# EAGLE board star (EAGLE 9.6.2)
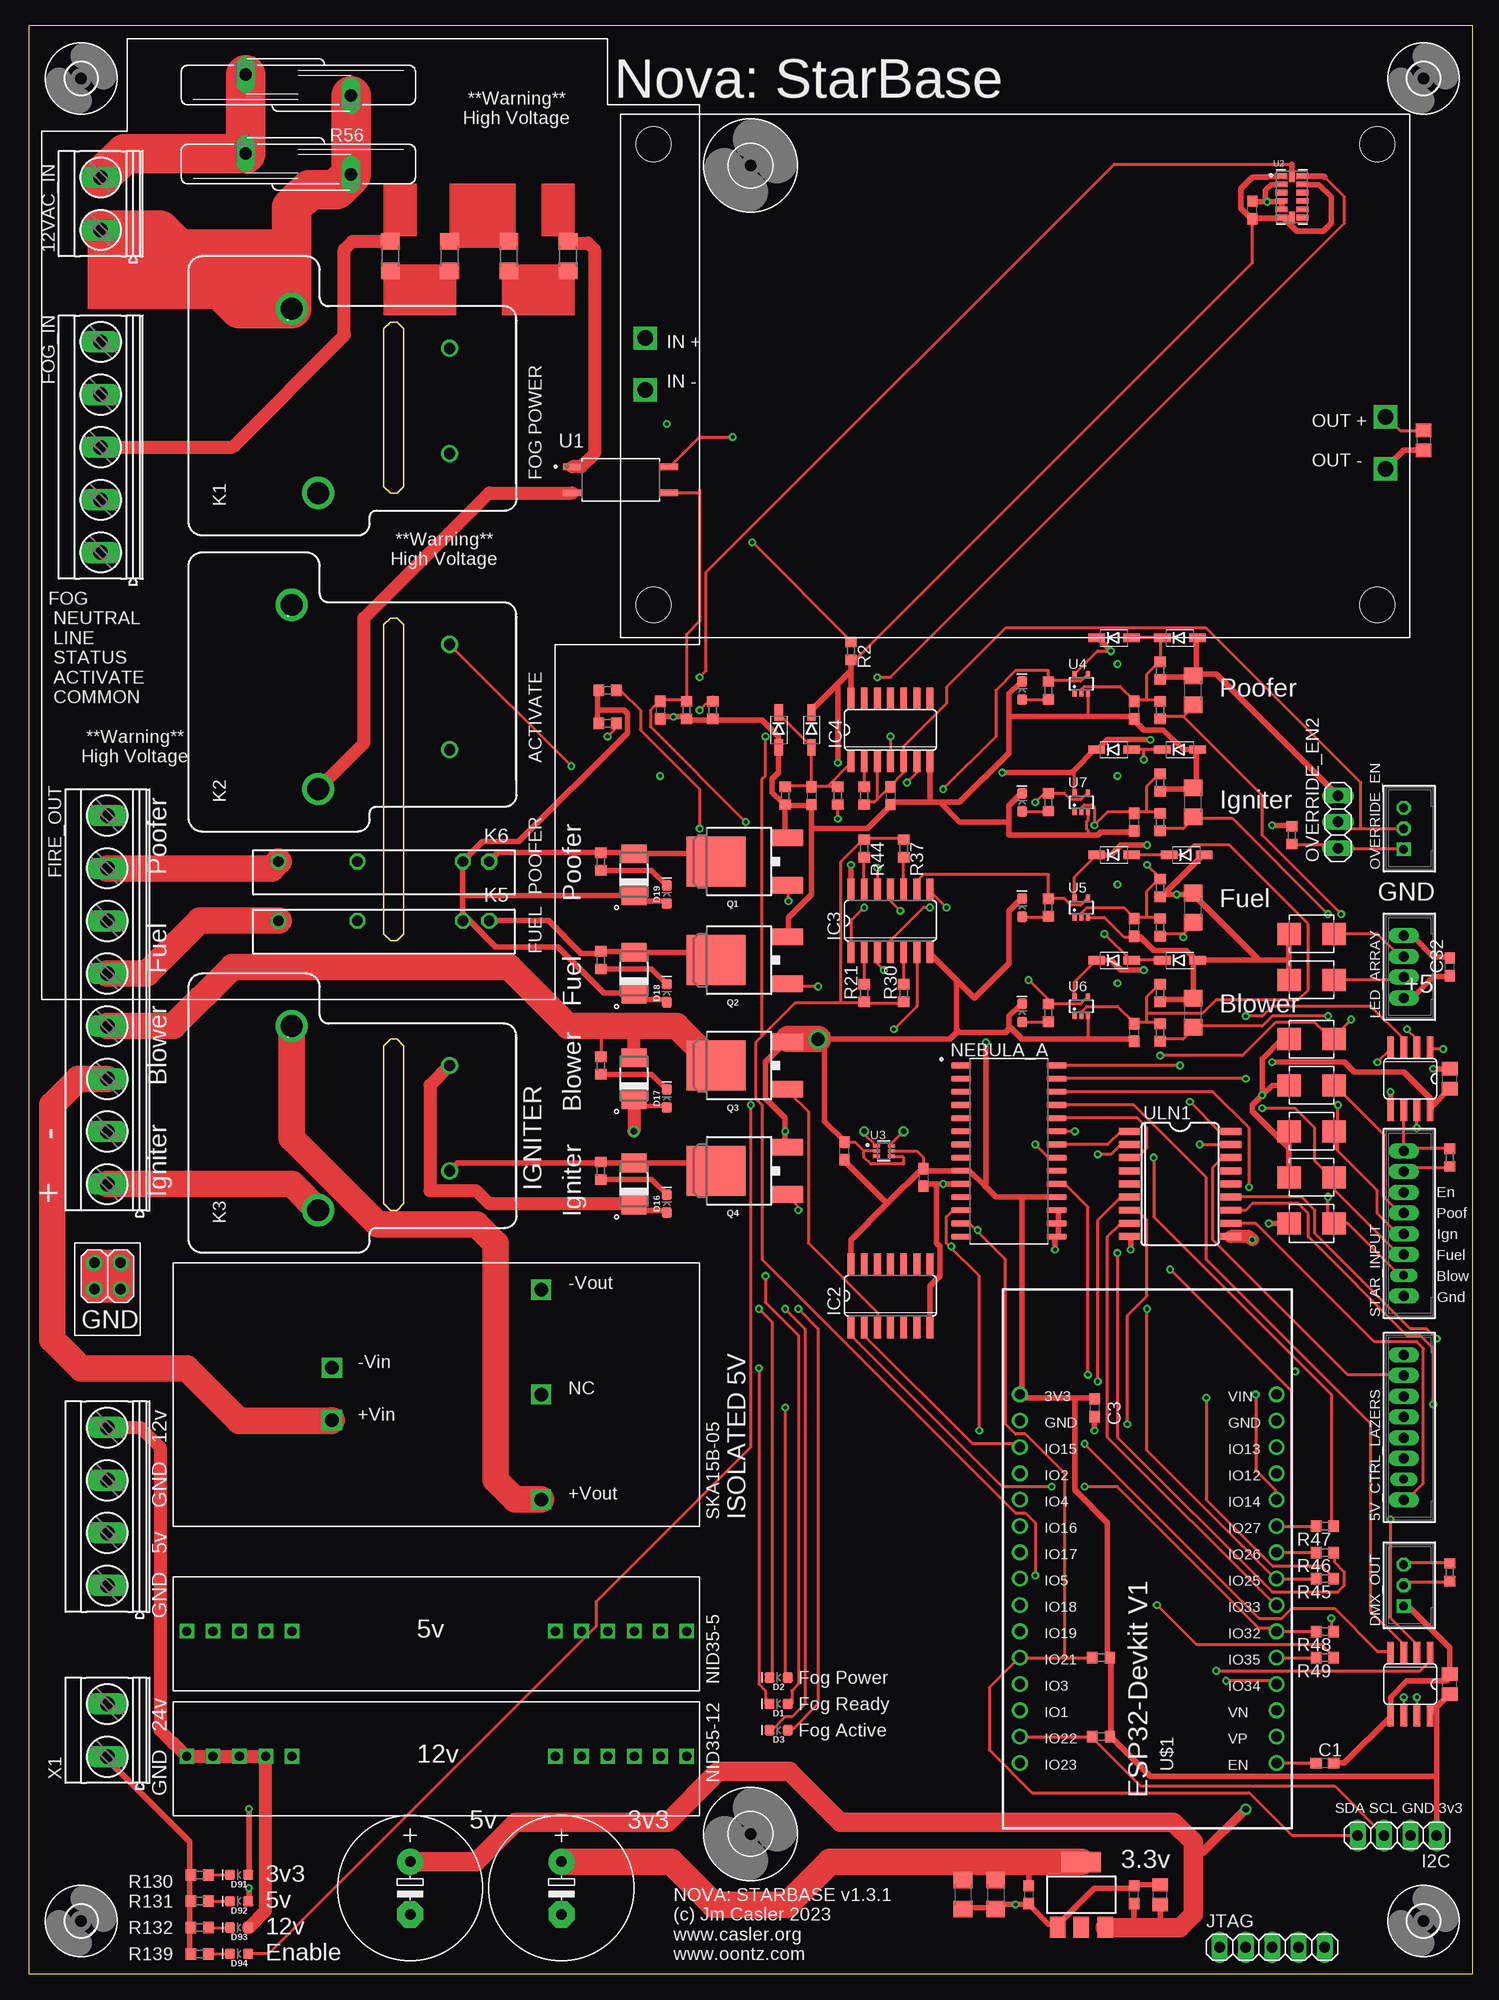
[diagram p2: board, top side]
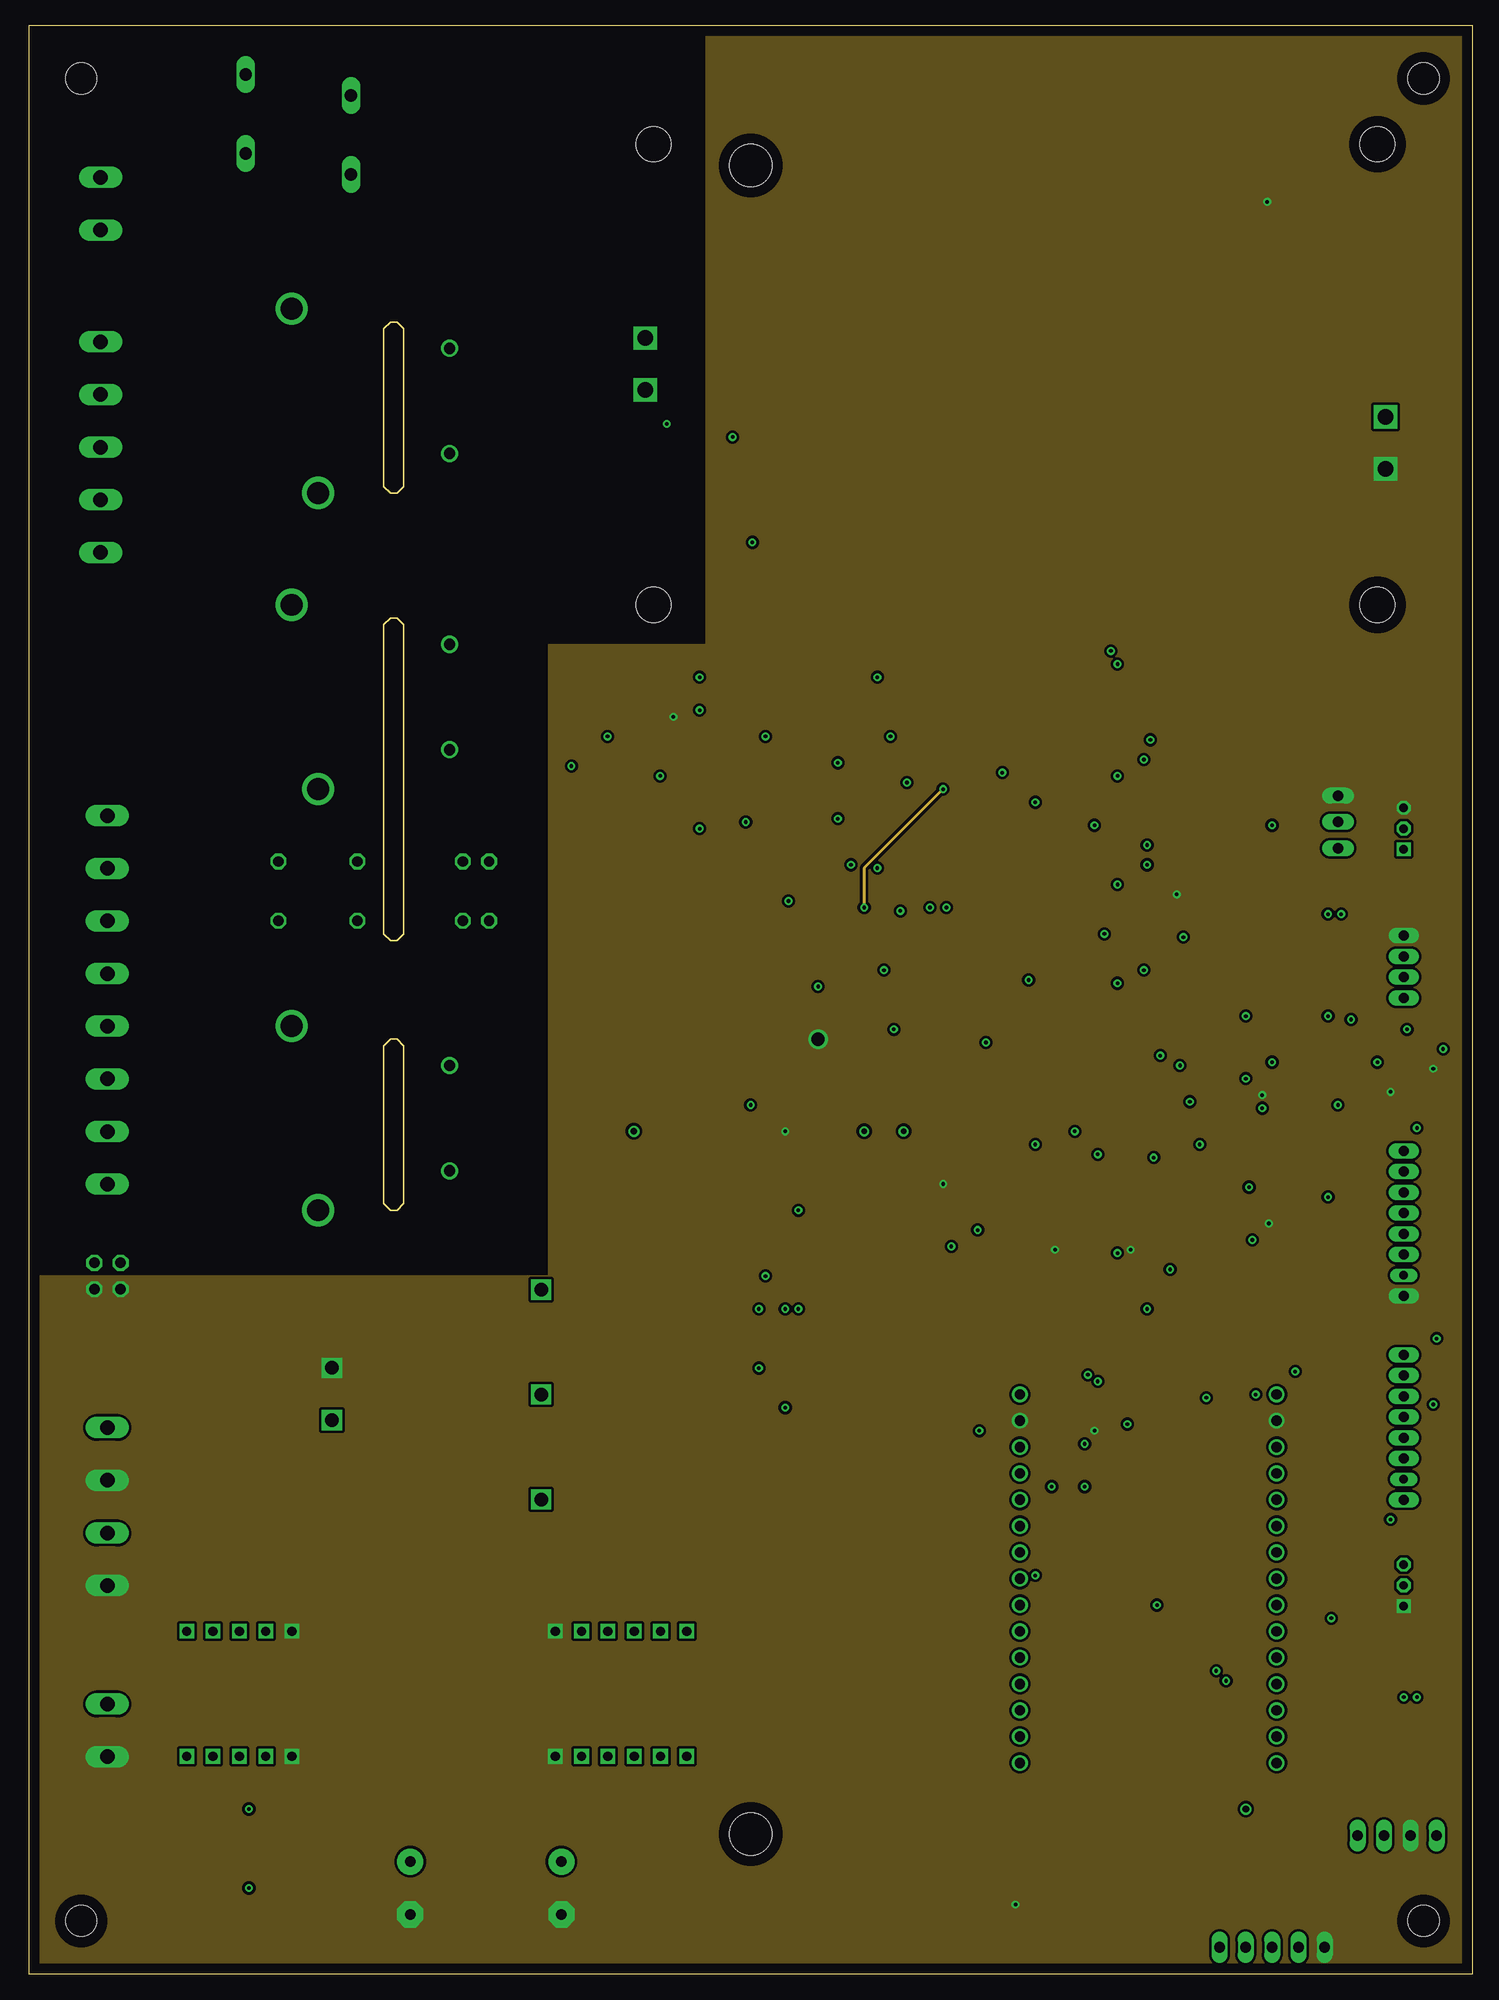
[diagram p3: board, inner layer $GND]
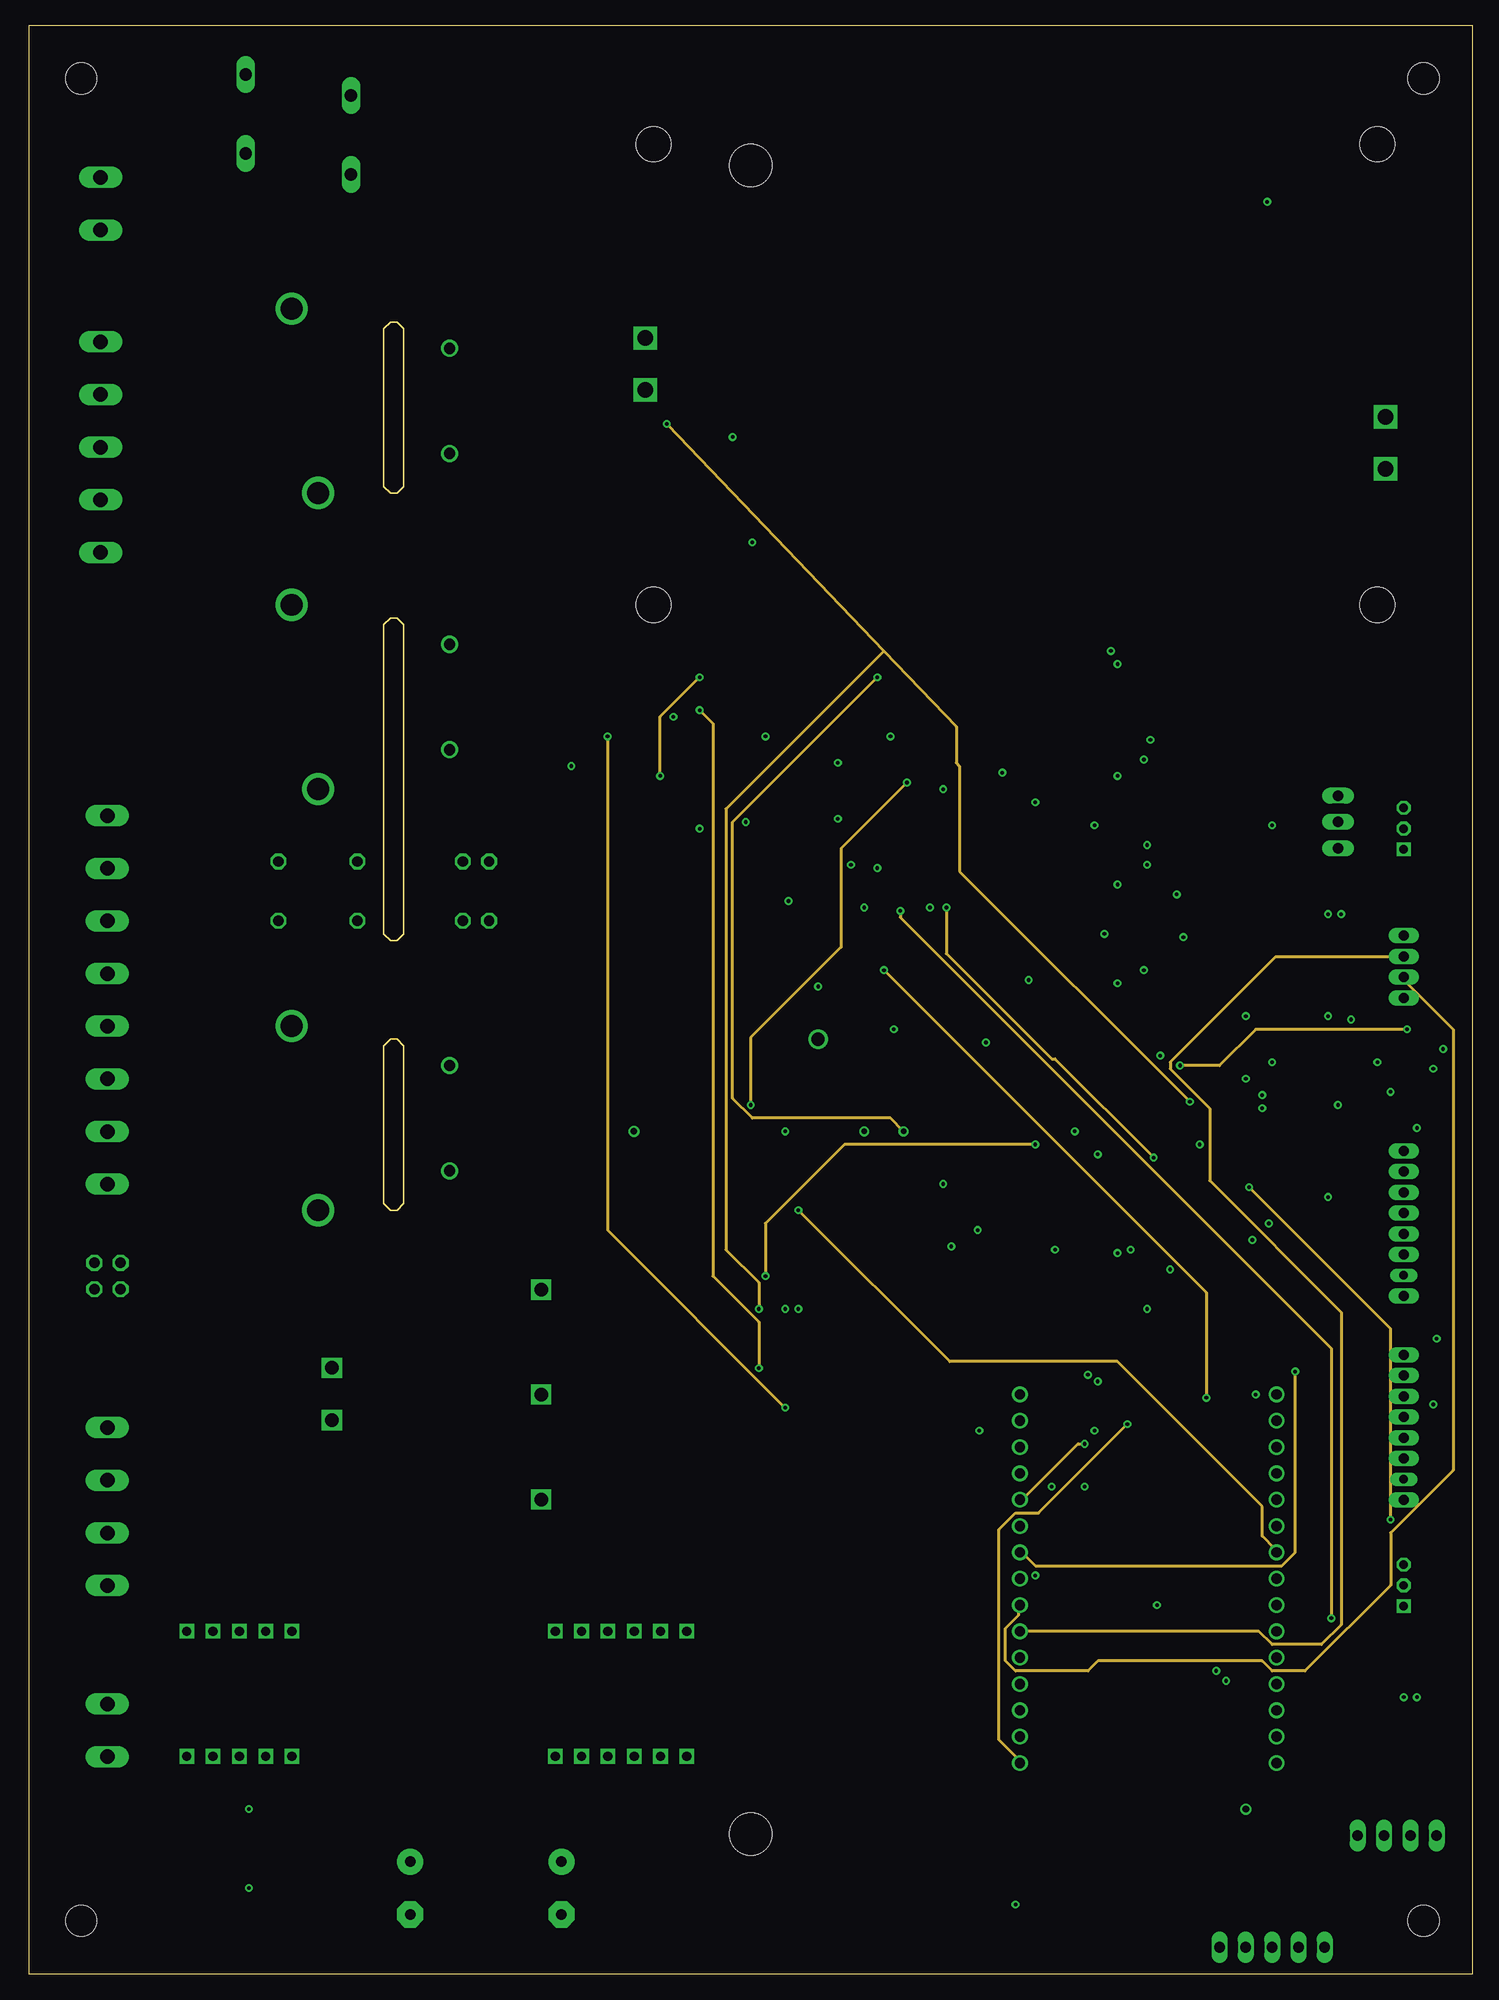
[diagram p4: board, inner layer SIGNAL3]
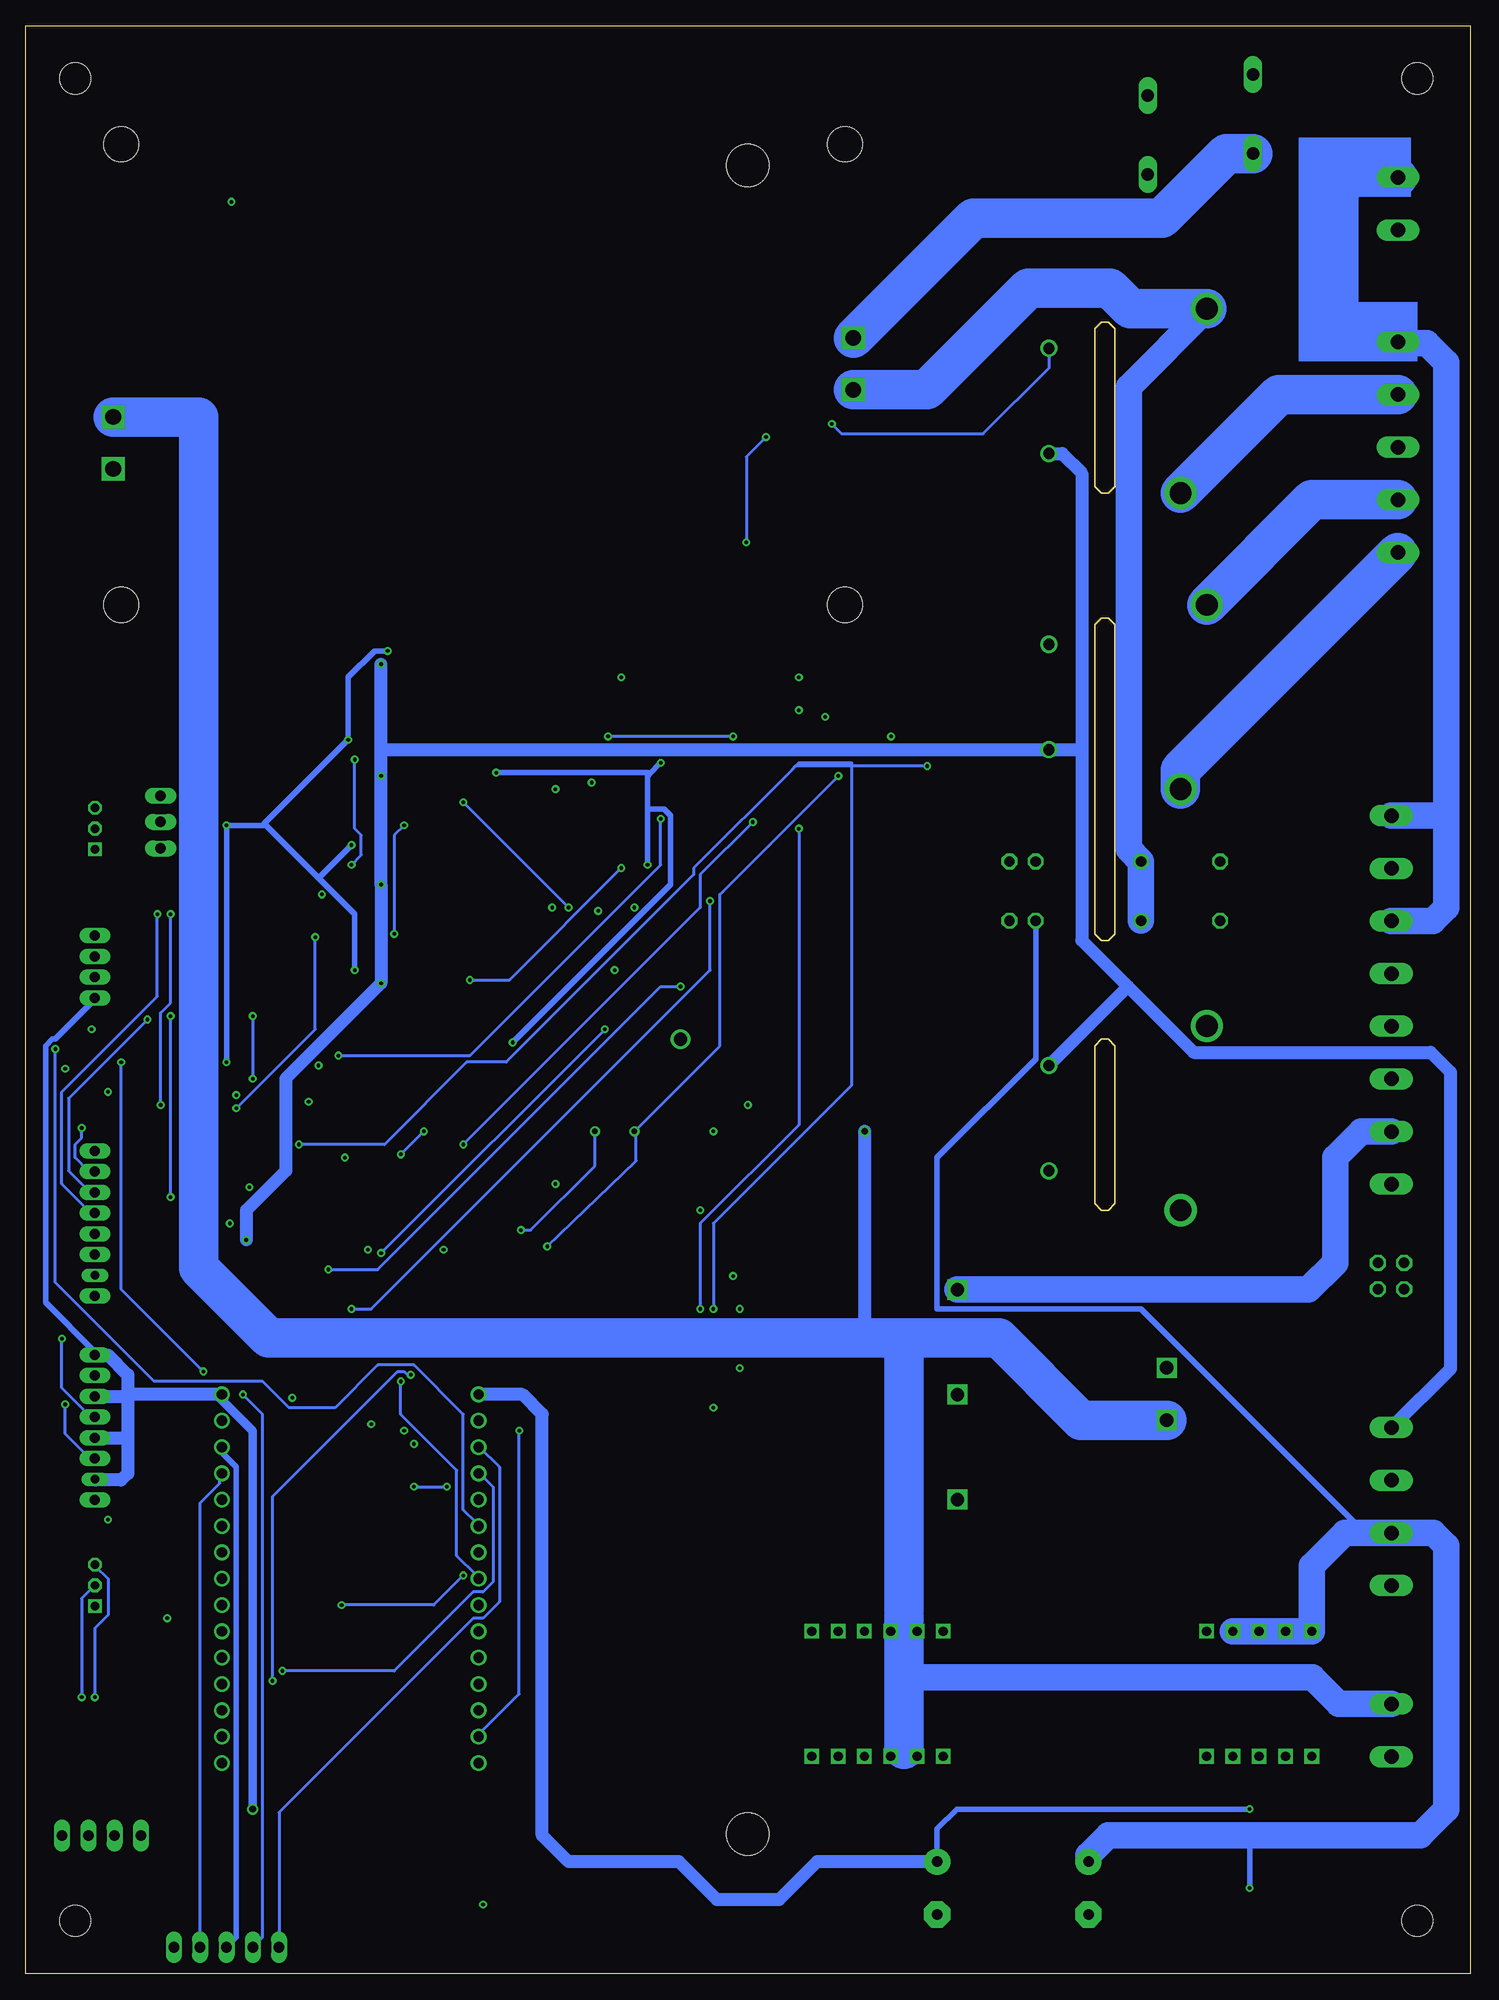
[diagram p5: board, bottom side, seen from below]

Size 139.37 x 187.95 mm. Coordinates in mm from the lower left corner, seen from the top.
Outline: 0,0 139.37,0 139.37,187.95 0,187.95 0,0
Copper layers (1+2*15+16): Top 0.035mm / dielectric 1.5mm / $GND 0.035mm / dielectric 0.15mm / SIGNAL3 0.035mm / dielectric 0.2mm / Bottom 0.035mm
Design rules "default *": minimum track width 6mil, minimum drill 0.35mm, track to track 6mil, track to pad 6mil, pad to pad 6mil, via to via 6mil, smd to smd 5mil, copper to edge 40mil, drill to drill 6mil, minimum pad ring 10mil, minimum via ring 8mil, stop-mask expansion 4mil, vias tented up to drill 20mil, thermal gap 10mil
Net classes: 0 default: width 0.305 mm, clearance 0.203 mm; 1 GND: width 0.305 mm, clearance 0.254 mm; 2 12V: width 1.27 mm, clearance 0.254 mm; 3 5V: width 0.508 mm, clearance 0.254 mm; 4 3V3: width 0.305 mm, clearance 0.254 mm; 5 12V_FUSED: width 0.635 mm, clearance 0.254 mm; 6 120VAC_PWR: width 1.27 mm, clearance 0.508 mm; 7 120VAC: width 1.27 mm, clearance 0.508 mm; 8 60V: width 1.27 mm, clearance 0.508 mm
tRestrict: area 34.3,142.9 to 36.2,159.4; area 34.3,99.7 to 36.2,130.8; area 34.3,73.7 to 36.2,90.2
bRestrict: area 34.3,142.9 to 36.2,159.4; area 34.3,99.7 to 36.2,130.8; area 34.3,73.7 to 36.2,90.2
Milling: 24 lines

## Footprints (pad centres in the part's own frame; a part is rotated, then mirrored left to right if it is on the bottom)
B8B-PH-K = drill 0.965 long: 1 -7,0; 3 -3,0; 4 -1,0; 5 1,0; 6 3,0; 7 5,0; 8 7,0 | drill 0.813 long: 2 -5,0
MKDSN1,5/2-5,08 = drill 1.397 pad 2 long: 1 -2.561,0.025; 2 2.519,0.025
C0603 = smd 1.1 x 1: 1 -0.85,0; 2 0.85,0
C0805 = smd 1.3 x 1.5: 1 -0.95,0; 2 0.95,0
C1206 = smd 1.6 x 1.8: 1 -1.4,0; 2 1.4,0
E5-13 = drill 1.016 pad 2.54: + -2.54,0 | drill 1.016 pad 2.54 octagon: - 2.54,0
LED-0603 = smd 1 x 1: A -0.877,0; C 0.877,0
DIOM4336X265N = smd 2.28 x 2.12: 1 -2.165,0; 2 2.165,0
DO-214AC = smd 1.8 x 2.4: A 2.025,0; C -2.025,0
SOD123 = smd 1.6 x 0.8: A 1.7,0; C -1.7,0
B3B-PH-K = drill 0.813 square: 1 -2,0 | drill 0.813 octagon: 2 0,0; 3 2,0
EPS-25 = drill 1.5 square: IN+ 2.365,28.92; IN- 2.365,23.92; OUT+ 73.795,21.3; OUT- 73.795,16.3 | hole 3.4: 3.175,47.625; 73.025,47.625; 73.025,3.175; 3.175,3.175
MKDSN1,5/8-5,08 = drill 1.397 pad 2 long: 1 -17.801,0.025; 2 -12.721,0.025; 3 -7.641,0.025; 4 -2.561,0.025; 5 2.519,0.025; 6 7.599,0.025; 7 12.679,0.025; 8 17.759,0.025
MKDSN1,5/5-5,08 = drill 1.397 pad 2 long: 1 -10.181,0.025; 2 -5.101,0.025; 3 -0.021,0.025; 4 5.059,0.025; 5 10.139,0.025
3,0 = hole 3: 0,0
4,1 = hole 4.1: 0,0
1X04 = drill 1.016 long: 1 -3.81,0; 2 -1.27,0; 3 1.27,0; 4 3.81,0
SO08 = smd 0.66 x 2.032: 1 -1.905,-3.073; 2 -0.635,-3.073; 3 0.635,-3.073; 4 1.905,-3.073; 5 1.905,3.073; 6 0.635,3.073; 7 -0.635,3.073; 8 -1.905,3.073
SO14 = smd 0.66 x 2.032: 1 -3.81,-3.073; 2 -2.54,-3.073; 3 -1.27,-3.073; 4 0,-3.073; 5 1.27,-3.073; 6 2.54,-3.073; 7 3.81,-3.073; 8 3.81,3.073; 9 2.54,3.073; 10 1.27,3.073; 11 0,3.073; 12 -1.27,3.073; 13 -2.54,3.073; 14 -3.81,3.073
SOT223 = smd 1.5 x 2: 1 -2.3,-3.15; 2 0,-3.15; 3 2.3,-3.15 | smd 3.8 x 2: 4 0,3.15
2X02 = drill 1.016 octagon: 1 -1.27,-1.27; 2 -1.27,1.27; 3 1.27,-1.27; 4 1.27,1.27
1X05 = drill 1.016 long: 1 -5.08,0; 2 -2.54,0; 3 0,0; 4 2.54,0; 5 5.08,0
JT1A-PCB = drill 1.1: 1 5.08,0; 2 -5.08,0 | drill 2.1: C -8.89,12.7; NO 8.89,15.24
AQG = drill 1 octagon: + -7.62,0; - -10.16,0; O1 2.54,0; O2 10.16,0
B4B-PH-K = drill 0.965 long: 1 -3,0; 2 -1,0; 3 1,0; 4 3,0
SOIC127P1030X265-28N = smd 1.9 x 0.6: 1 -4.605,8.255; 2 -4.605,6.985; 3 -4.605,5.715; 4 -4.605,4.445; 5 -4.605,3.175; 6 -4.605,1.905; 7 -4.605,0.635; 8 -4.605,-0.635; 9 -4.605,-1.905; 10 -4.605,-3.175; 11 -4.605,-4.445; 12 -4.605,-5.715; 13 -4.605,-6.985; 14 -4.605,-8.255; 15 4.605,-8.255; 16 4.605,-6.985; 17 4.605,-5.715; 18 4.605,-4.445; 19 4.605,-3.175; 20 4.605,-1.905; 21 4.605,-0.635; 22 4.605,0.635; 23 4.605,1.905; 24 4.605,3.175; 25 4.605,4.445; 26 4.605,5.715; 27 4.605,6.985; 28 4.605,8.255
NID35 = drill 0.9 square: COM1 11.46,5.73; COM2 36.86,5.73; NC 44.48,5.73; RC 49.56,5.73; TRIM 47.02,5.73; VIN1 39.4,5.73; VIN2 41.94,5.73; VOUT1 1.3,5.73; VOUT2 3.84,5.73; VOUT3 6.38,5.73; VOUT4 8.92,5.73
1X03 = drill 1.016 long: 1 -2.54,0; 2 0,0; 3 2.54,0
MKDSN1,5/4-5,08 = drill 1.397 pad 2 long: 1 -7.641,0.025; 2 -2.561,0.025; 3 2.519,0.025; 4 7.599,0.025
DPAK = smd 1.6 x 3: 1 -2.28,-5.31; 3 2.28,-5.31 | smd 4.826 x 5.715: 4 0,1.588
R0603 = smd 1 x 1.1: 1 -0.85,0; 2 0.85,0
R1206 = smd 1.6 x 1.803: 1 -1.422,0; 2 1.422,0
S20K20 = drill 1.194 long: 1 -1.016,-5.08; 2 1.016,5.08
SKA15B = drill 1.3 square: +VIN 15.3,10.22; +VOUT 35.5,2.58; -VIN 15.3,15.28; -VOUT 35.5,22.82; NC 35.5,12.7
SOP254P1015X230-4N = smd 1.84 x 0.64: 1 -4.685,1.27; 2 -4.685,-1.27; 3 4.685,-1.27; 4 4.685,1.27
PQFN80P300X500X100-14N = smd 1.145 x 0.55: 1 -1.01,2; 2 -1.01,1.2; 3 -1.01,0.4; 4 -1.01,-0.4; 5 -1.01,-1.2; 6 -1.01,-2; 8 1.01,-2; 9 1.01,-1.2; 10 1.01,-0.4; 11 1.01,0.4; 12 1.01,1.2; 13 1.01,2 | smd 0.55 x 1.145: 7 0,-2.01; 14 0,2.01
SOT50P160X60-6N = smd 0.67 x 0.3: 1 -0.735,0.5; 2 -0.735,0; 3 -0.735,-0.5; 4 0.735,-0.5; 5 0.735,0; 6 0.735,0.5
SC70-5 = smd 0.4 x 0.6: 1 -0.65,-0.95; 2 0,-0.95; 3 0.65,-0.95; 4 0.65,0.95; 5 -0.65,0.95
ESP32-DEVKITV1 = drill 1 pad 1.422: 1 -22.87,-13.54; 2 -20.33,-13.54; 3 -17.79,-13.54; 4 -15.25,-13.54; 5 -12.71,-13.54; 6 -10.17,-13.54; 7 -7.63,-13.54; 8 -5.09,-13.54; 9 -2.55,-13.54; 10 -0.01,-13.54; 11 2.53,-13.54; 12 5.07,-13.54; 13 7.61,-13.54; 14 10.15,-13.54; 15 12.69,-13.54; 16 12.69,11.23; 17 10.15,11.23; 18 7.61,11.23; 19 5.07,11.23; 20 2.53,11.23; 21 -0.01,11.23; 22 -2.55,11.23; 23 -5.09,11.23; 24 -7.63,11.23; 25 -10.17,11.23; 26 -12.71,11.23; 27 -15.25,11.23; 28 -17.79,11.23; 29 -20.33,11.23; 30 -22.87,11.23
SO18L = smd 0.66 x 2.032: 1 -0.635,-4.902; 2 0.635,-4.902; 3 1.905,-4.902; 4 3.175,-4.902; 5 4.445,-4.902; 6 5.715,-4.902; 7 6.985,-4.902; 8 8.255,-4.902; 9 9.525,-4.902; 10 9.525,4.902; 11 8.255,4.902; 12 6.985,4.902; 13 5.715,4.902; 14 4.445,4.902; 15 3.175,4.902; 16 1.905,4.902; 17 0.635,4.902; 18 -0.635,4.902

## Placement (x,y rotation side)
5V_CTRL_LAZERS  B8B-PH-K  [B8B-PH-K]  132.72,52.7 90 top
12VAC_IN  MKDSN1,5/2-5,08  [MKDSN1,5/2-5,08]  6.99,170.81 90 top
C1  10uf  [C0603]  125.09,20.32 0 top
C2  C_1UF/50V_0603  [C0603]  118.11,170.18 90 top
C3  10uf  [C0603]  102.87,54.61 270 top
C4  C_1UF/50V_0603  [C0603]  78.74,79.38 90 top
C6  1uf  [C0805]  109.22,7.62 90 top
C7  C_1NF/50V_0603  [C0603]  60.96,121.92 270 top
C8  10uf  [C0603]  86.36,76.83 270 top
C11  C_100UF/6.3V_1206  [C1206]  93.34,7.62 270 top
C12  C_100UF/6.3V_1206  [C1206]  90.17,7.62 270 top
C13  C_1NF/2KV_1206  [C1206]  112.39,123.83 90 top
C14  1uf  [C0805]  137.16,86.36 90 top
C15  C_100PF/50V_0603  [C0603]  106.68,121.92 270 top
C16  C_1NF/50V_0603  [C0603]  75.56,113.67 270 top
C17  C_1NF/50V_0603  [C0603]  83.19,113.67 270 top
C18  C_1NF/2KV_1206  [C1206]  112.39,113.03 90 top
C19  C_100PF/50V_0603  [C0603]  106.68,111.12 270 top
C20  C_1NF/2KV_1206  [C1206]  112.39,102.87 90 top
C21  C_100PF/50V_0603  [C0603]  106.68,100.97 270 top
C22  C_1NF/2KV_1206  [C1206]  112.39,92.71 90 top
C23  C_100PF/50V_0603  [C0603]  106.68,90.81 270 top
C25  1uf  [C0805]  134.62,147.96 270 top
C28  2200uf  [E5-13]  51.44,8.26 270 top
C32  C_1UF/50V_0603  [C0603]  137.16,97.16 90 top
C33  1uf  [C0805]  137.16,27.94 90 top
C35  10uf  [C0603]  106.68,7.62 90 top
C36  10uf  [C0603]  96.52,7.62 270 top
C89  2200uf  [E5-13]  36.83,8.26 270 top
D1  red  [LED-0603]  72.39,26.04 180 top
D2  blue  [LED-0603]  72.39,28.57 180 top
D3  blue  [LED-0603]  72.39,23.5 180 top
D4  SMBJ8.0CA  [DIOM4336X265N]  123.83,100.33 0 top
D5  SMBJ8.0CA  [DIOM4336X265N]  123.83,76.83 0 top
D6  green  [LED-0603]  95.89,123.83 90 top
D7  green  [LED-0603]  95.89,113.03 90 top
D8  green  [LED-0603]  95.89,102.87 90 top
D9  green  [LED-0603]  95.89,92.71 90 top
D10  SMBJ8.0CA  [DIOM4336X265N]  123.83,72.39 0 top
D11  SMBJ8.0CA  [DIOM4336X265N]  123.83,81.28 0 top
D12  D_SS210_MDD_SMA  [DO-214AC]  58.42,106.05 90 top
D13  D_SS210_MDD_SMA  [DO-214AC]  58.42,96.52 90 top
D14  D_SS210_MDD_SMA  [DO-214AC]  58.42,86.36 90 top
D15  D_SS210_MDD_SMA  [DO-214AC]  58.42,76.2 90 top
D16  blue  [LED-0603]  61.59,74.3 90 top
D17  blue  [LED-0603]  61.59,84.45 90 top
D18  blue  [LED-0603]  61.59,94.61 90 top
D19  blue  [LED-0603]  61.59,104.14 90 top
D20  SMBJ8.0CA  [DIOM4336X265N]  123.83,90.17 0 top
D21  SMBJ8.0CA  [DIOM4336X265N]  123.83,95.89 0 top
D22  D_B5819W-SL_CHANGJ_SOD123  [SOD123]  104.78,128.91 0 top
D23  D_B5819W-SL_CHANGJ_SOD123  [SOD123]  111.12,128.91 0 top
D24  D_B5819W-SL_CHANGJ_SOD123  [SOD123]  104.78,118.11 0 top
D25  D_B5819W-SL_CHANGJ_SOD123  [SOD123]  111.12,118.11 0 top
D26  D_B5819W-SL_CHANGJ_SOD123  [SOD123]  104.78,107.95 0 top
D27  D_B5819W-SL_CHANGJ_SOD123  [SOD123]  111.76,107.95 0 top
D28  D_B5819W-SL_CHANGJ_SOD123  [SOD123]  104.78,97.79 0 top
D29  D_B5819W-SL_CHANGJ_SOD123  [SOD123]  111.12,97.79 0 top
D30  D_B5819W-SL_CHANGJ_SOD123  [SOD123]  75.56,120.02 270 top
D31  D_B5819W-SL_CHANGJ_SOD123  [SOD123]  72.39,120.02 270 top
D91  red  [LED-0603]  20.32,9.53 180 top
D92  green  [LED-0603]  20.32,6.99 180 top
D93  blue  [LED-0603]  20.32,4.45 180 top
D94  yellow  [LED-0603]  20.32,1.91 180 top
D139  SMBJ8.0CA  [DIOM4336X265N]  123.83,85.72 0 top
DMX_OUT  B3B-PH-K  [B3B-PH-K]  132.72,37.47 90 top
EPP-120S-24  EPP-120S  [EPS-25]  57.15,128.91 0 top
FIRE_OUT  MKDSN1,5/8-5,08  [MKDSN1,5/8-5,08]  7.62,93.98 90 top
FOG_IN  MKDSN1,5/5-5,08  [MKDSN1,5/5-5,08]  6.99,147.32 90 top
H1  MOUNT-HOLE3.0  [3,0]  134.62,5.08 0 top
H2  MOUNT-HOLE3.0  [3,0]  134.62,182.88 0 top
H3  MOUNT-HOLE3.0  [3,0]  5.08,182.88 0 top
H4  MOUNT-HOLE3.0  [3,0]  5.08,5.08 0 top
H5  MOUNT-HOLE4.1  [4,1]  69.69,174.47 0 top
H6  MOUNT-HOLE4.1  [4,1]  69.69,13.47 0 top
I2C  [1X04]  132.08,13.34 180 top
IC1  MAX481CSA  [SO08]  133.35,86.36 180 top
IC2  74HCT08D  [SO14]  83.19,65.41 0 top
IC3  74HCT08D  [SO14]  83.19,101.6 0 top
IC4  7404D  [SO14]  83.19,120.02 0 top
IC8  MAX481CSA  [SO08]  133.35,27.94 180 top
IC22  LD117AS12TR  [SOT223]  101.6,7.62 0 top
JP1  [2X02]  7.62,67.31 0 top
JTAG  [1X05]  120.02,2.54 180 top
K1  T90-12VDC-TL-A  [JT1A-PCB]  40.64,151.76 90 top
K2  T90-12VDC-TL-A  [JT1A-PCB]  40.64,123.19 90 top
K3  T90-12VDC-TL-A  [JT1A-PCB]  40.64,82.55 90 top
K5  AQG22110  [AQG]  34.29,101.6 180 top
K6  AQG22110  [AQG]  34.29,107.31 180 top
LED_ARRAY  B4B-PH-K  [B4B-PH-K]  132.72,97.16 90 top
NEBULA_A  MCP23017-E/SO  [SOIC127P1030X265-28N]  94.61,79.38 0 top
NID35-5  NID35  [NID35]  13.97,27.3 0 top
NID35-12  NID35  [NID35]  13.97,15.24 0 top
OVERRIDE_EN  B3B-PH-K  [B3B-PH-K]  132.72,110.49 90 top
OVERRIDE_EN2  [1X03]  126.36,111.12 90 top
POWER_IN  MKDSN1,5/4-5,08  [MKDSN1,5/4-5,08]  7.62,45.09 90 top
Q1  35A/25V/8.5mΩ  [DPAK]  67.94,107.31 90 top
Q2  35A/25V/8.5mΩ  [DPAK]  67.94,97.79 90 top
Q3  35A/25V/8.5mΩ  [DPAK]  67.94,87.63 90 top
Q4  35A/25V/8.5mΩ  [DPAK]  67.94,77.47 90 top
R1  120  [R0603]  137.16,78.74 270 top
R2  R_150R_0603  [R0603]  79.38,127.64 270 top
R3  R_1.2K_0603  [R0603]  55.88,123.83 180 top
R4  R_1.2K_0603  [R0603]  55.88,120.65 180 top
R5  120  [R0603]  137.16,38.73 270 top
R6  R_100K_0603  [R0603]  73.03,113.67 90 top
R7  1k  [R0603]  66.04,121.92 270 top
R8  1k  [R0603]  63.5,121.92 270 top
R9  R_330R_0603  [R0603]  109.22,121.92 90 top
R10  R_4.7K_1206  [R1206]  52.07,165.74 90 top
R11  R_4.7K_1206  [R1206]  46.35,165.74 270 top
R12  R_4.7K_1206  [R1206]  40.64,165.74 90 top
R13  R_4.7K_1206  [R1206]  34.92,165.74 270 top
R14  R_10K_0603  [R0603]  109.22,125.73 90 top
R15  R_2K_0603  [R0603]  55.24,77.47 90 top
R16  R_1K_0603  [R0603]  98.42,123.83 90 top
R19  R_5.1K_0603  [R0603]  78.11,113.67 90 top
R20  R_5.1K_0603  [R0603]  80.64,113.67 270 top
R21  R_2K_0603  [R0603]  80.64,94.61 90 top
R22  R_330R_0603  [R0603]  109.22,111.12 90 top
R23  R_10K_0603  [R0603]  109.22,114.94 90 top
R25  R_1K_0603  [R0603]  98.42,113.03 90 top
R26  R_3K_0603  [R0603]  103.5,22.86 0 top
R27  R_3K_0603  [R0603]  103.5,30.48 0 top
R30  R_2K_0603  [R0603]  84.45,94.61 90 top
R31  R_330R_0603  [R0603]  109.22,100.97 90 top
R32  R_10K_0603  [R0603]  109.22,104.78 90 top
R34  R_1K_0603  [R0603]  98.42,102.87 90 top
R37  R_2K_0603  [R0603]  84.45,108.58 270 top
R38  R_330R_0603  [R0603]  109.22,90.81 90 top
R39  R_10K_0603  [R0603]  109.22,94.61 90 top
R41  R_1K_0603  [R0603]  98.42,92.71 90 top
R44  R_2K_0603  [R0603]  80.64,108.58 270 top
R45  R_6.2K_0603  [R0603]  125.09,38.1 180 top
R46  R_6.2K_0603  [R0603]  125.09,40.64 180 top
R47  R_6.2K_0603  [R0603]  125.09,43.18 180 top
R48  R_6.2K_0603  [R0603]  125.09,33.02 180 top
R49  R_0R_0603  [R0603]  125.09,30.48 180 top
R50  R_1K_0603  [R0603]  121.92,109.86 270 top
R55  S20K20  [S20K20]  26.04,174.62 90 top
R56  S20K20  [S20K20]  26.04,182.25 90 top
R60  R_1K_0603  [R0603]  55.24,107.31 90 top
R61  R_1K_0603  [R0603]  55.24,97.79 90 top
R62  R_15K_0603  [R0603]  55.24,87.63 90 top
R130  1k  [R0603]  16.51,9.53 180 top
R131  2.2k  [R0603]  16.51,6.99 180 top
R132  1k  [R0603]  16.51,4.45 180 top
R139  1k  [R0603]  16.51,1.91 180 top
SKA15B-05  SKA15B  [SKA15B]  13.97,43.18 0 top
STAR_INPUT  B8B-PH-K  [B8B-PH-K]  132.72,72.39 90 top
U1  TCLT1600  [SOP254P1015X230-4N]  57.15,144.15 0 top
U2  ADXL343BCCZ-RL7  [PQFN80P300X500X100-14N]  121.92,171.45 0 top
U3  TMP102AIDRLR  [SOT50P160X60-6N]  82.55,79.38 0 top
U4  SN74LVC1G17DCK  [SC70-5]  101.6,124.46 0 top
U5  SN74LVC1G17DCK  [SC70-5]  101.6,102.87 0 top
U6  SN74LVC1G17DCK  [SC70-5]  101.6,93.34 0 top
U7  SN74LVC1G17DCK  [SC70-5]  101.6,113.03 0 top
U$1  ESP32DEVKITV1  [ESP32-DEVKITV1]  109.22,33.02 270 top
ULN1  [SO18L]  111.12,80.64 270 top
X1  MKDSN1,5/2-5,08  [MKDSN1,5/2-5,08]  7.62,23.5 90 top

## Tracks (layer width: path | path; a pad name or v marks a point on that pad's centre or on a via)
2  (via drill 0.35)
  Top 0.305: IC8.1 135.25,30.16 134.3,29.21 v114.62,29.21
  Bottom 0.305: v114.62,29.21 103.82,29.21 96.2,36.83 95.25,36.83 94.3,37.78 94.3,46.99 95.57,48.26 U$1.4
4  (via drill 0.35)
  Top 0.305: v101.92,51.12 118.75,34.29 120.97,34.29 121.92,35.24 126.05,35.24 130.18,31.11 131.44,31.11 IC8.4
  SIGNAL3 0.305: v101.92,51.12 101.28,51.12 95.89,45.72 U$1.5
5  (via drill 0.35)
  Top 0.305: ULN1.6 105.41,74.93 103.19,72.71 v103.19,57.15
  Bottom 0.305: v103.19,57.15 103.19,53.98 97.79,48.58 97.79,40.32 95.89,38.42 U$1.8
12
  Bottom 0.305: JTAG.2 122.56,45.4 120.65,47.31 120.65,48.26 U$1.27
13
  Bottom 0.508: JTAG.3 119.06,3.49 119.06,48.9 120.33,50.16 120.33,50.8 U$1.28
14  (via drill 0.35)
  Top 0.305: v118.43,55.88 118.43,48.58 120.33,46.67 120.33,46.04 U$1.26
  Bottom 0.305: v118.43,55.88 116.52,53.98 116.52,3.49 JTAG.4
15
  Top 0.305: IC2.2 80.64,61.59 91.12,51.12 95.57,51.12 U$1.3
  Bottom 0.305: JTAG.5 114.94,15.56 96.2,34.29 95.25,34.29 93.66,35.88 93.66,48.9 95.57,50.8 U$1.3
16  (via drill 0.35)
  Top 0.305: v136.53,89.22 135.25,89.22 IC1.1
  Bottom 0.305: v136.53,89.22 136.53,66.67 127,57.15 116.52,57.15 113.98,54.61 109.54,54.61 105.41,58.74 101.92,58.74 97.16,53.98 97.16,44.77 95.89,43.5 U$1.6
17  (via drill 0.35)
  Top 0.305: v130.18,87.95 131.44,89.22 IC1.4
  SIGNAL3 0.305: v122.24,58.1 122.24,40.64 120.97,39.37 97.16,39.37 95.89,40.64 U$1.7
  Bottom 0.305: v130.18,87.95 130.18,66.04 v122.24,58.1
18
  Top 0.305: D21.2 132.72,95.89 LED_ARRAY.2
  SIGNAL3 0.305: U$1.9 95.57,35.56 95.57,34.61 94.3,33.34 94.3,30.16 95.25,29.21 102.23,29.21 103.19,30.16 119.06,30.16 120.02,29.21 123.19,29.21 131.44,37.47 131.44,42.55 137.48,48.58 137.48,91.12 132.72,95.89 LED_ARRAY.2
19
  Top 0.305: D4.2 130.18,100.33 132.08,98.42 132.72,98.42 LED_ARRAY.3
  SIGNAL3 0.305: U$1.10 95.89,33.02 118.75,33.02 120.02,31.75 124.78,31.75 126.68,33.66 126.68,63.82 113.98,76.52 113.98,83.5 110.17,87.31 110.17,87.95 120.33,98.11 132.72,98.11 LED_ARRAY.3
21/SDA  (via drill 0.35, 0.55)
  Top 0.305: 100.01,30.48 95.89,30.48 U$1.11 95.57,30.48 92.71,27.62 92.71,21.59 96.84,17.46 117.79,17.46 121.92,13.34 I2C.4 | 100.01,30.48 R27.1 | NEBULA_A.13 90.81,72.39 91.52,71.68 | 91.52,71.68 94.3,68.9 94.3,53.02 95.25,52.07 96.2,52.07 100.01,48.26 100.01,30.48 | v91.6,71.75 91.52,71.68 | U3.6 83.28,80.11 v84.45,81.28 | 125.09,173.35 127,171.45 127,168.91 83.19,125.09 v81.92,125.09
  Top 0.508: U2.13 125,173.45 125.09,173.35
  SIGNAL3 0.305: v81.92,125.09 67.94,111.12 67.94,84.45 69.85,82.55 83.19,82.55 v84.45,81.28
  Bottom 0.305: v91.6,71.75 90.65,71.75 84.45,77.95 v84.45,81.28
22/SCL  (via drill 0.35, 0.55)
  Top 0.305: 102.55,22.86 95.89,22.86 U$1.14 | NEBULA_A.12 89.22,73.66 88.58,73.03 88.58,70.48 88.98,70.09 | 88.98,70.09 91.76,67.31 v91.76,52.39 | I2C.3 126.05,18.1 107.31,18.1 102.55,22.86 | 102.55,22.86 R26.1 | v89.06,70.17 88.98,70.09 | U3.1 80.64,81.05 v80.64,81.28 | 121.92,174.62 104.78,174.62 65.41,135.25 65.41,125.73 v64.77,125.09
  Top 0.508: U2.14 121.92,174.62
  SIGNAL3 0.305: v64.77,125.09 60.96,121.28 v60.96,115.57
  Bottom 0.305: v91.76,52.39 91.76,26.99 95.57,23.18 U$1.14 | v89.06,70.17 80.49,78.42 80.49,81.12 v80.64,81.28 72.39,89.53 72.39,104.14 v60.96,115.57
23  (via drill 0.35)
  Top 0.305: ULN1.7 107,73.66 107.95,72.71 107.95,65.41 106.05,63.5 v106.05,53.02
  SIGNAL3 0.305: v106.05,53.02 97.47,44.45 95.25,44.45 93.66,42.86 93.66,22.54 95.57,20.64 U$1.15
25_POOFER  (via drill 0.35)
  Top 0.305: R45.2 120.65,38.1 U$1.23 120.33,38.1 107.95,50.48 v107.95,64.14 | v73.34,103.5 73.34,104.78 Q1.1
  Bottom 0.305: v73.34,103.5 73.34,96.84 106.05,64.14 v107.95,64.14
26_BOOM_IGNITER  (via drill 0.35)
  Top 0.305: R46.2 120.65,40.64 U$1.24 | v74.3,73.66 74.3,73.98 73.34,74.93 Q4.1
  SIGNAL3 0.305: v74.3,73.66 88.9,59.05 105.09,59.05 119.06,45.09 119.06,42.23 120.33,40.96 U$1.24
27_BOOM_FUEL  (via drill 0.35)
  Top 0.305: 121.92,43.18 120.65,43.18 U$1.25 | 121.92,43.18 R47.2 | v76.2,95.25 73.34,95.25 Q2.1 | v110.17,67.94 121.92,56.2 121.92,43.18
  Bottom 0.305: v76.2,95.25 78.11,95.25 105.41,67.94 v110.17,67.94
32_BOOM_BLOWER  (via drill 0.35)
  Top 0.305: R48.2 120.65,33.02 U$1.21 120.33,33.34 118.75,33.34 105.09,46.99 v101.92,46.99 | IC2.1 79.38,61.59 93.98,46.99 v98.74,46.99
  Bottom 0.305: v101.92,46.99 v98.74,46.99
33
  Top 0.305: ULN1.8 105.41,72.39 104.14,71.12 104.14,51.75 120.33,35.56 U$1.22
34  (via drill 0.35)
  Top 0.305: NEBULA_A.19 100.01,76.2 102.23,73.98 v102.23,57.78 | v115.57,28.26 120.33,28.26 U$1.19
  Bottom 0.305: v102.23,57.78 102.55,57.78 102.87,58.1 103.5,58.1 115.57,46.04 v115.57,28.26
35
  Top 0.305: R49.2 120.65,30.48 U$1.20
120_LINE
  Top 3.81: R56.1 R55.1 29.67,172.16 27.12,172.16 25.4,170.44 K1.NO 20.32,160.66 12.72,168.25 12VAC_IN.1
  Bottom 2.54: K1.NO 32.94,153.11 32.94,108.51 K6.O1 K5.O1
  Bottom 3.81: K1.NO 32.76,160.66 34.74,162.64 42.6,162.64 52.41,152.82 EPP-120S-24.IN-
120_NEUTRAL
  Top 3.81: 12VAC_IN.2 9.27,175.64 R55.2 R56.2
  Bottom 2.54: FOG_IN.5 6.83,157.33 4.16,157.33 2.29,155.45 2.29,111.76 | 2.29,111.76 2.29,102.87 3.58,101.58 FIRE_OUT.6 | FIRE_OUT.8 2.31,111.74 2.29,111.76
  Bottom 3.81: 12VAC_IN.2 11.45,173.33 13.97,170.81 13.97,160.66 10.77,157.46 FOG_IN.5 | R55.2 23.51,175.64 29.75,169.41 47.94,169.41 EPP-120S-24.IN+
+3V3  (via drill 0.35)
  Top 0.305: U3.5 85.72,79.38 86.36,78.74 86.36,77.79 | U2.7 121.18,169.44 121.13,169.39 | C2.1 118.11,165.1 79.38,126.36 | U6.5 100.95,95.67 D28.C | U5.5 100.95,105.83 D26.C | U7.5 100.95,116.19 100.97,116.2 | U4.5 103.17,127.64 v104.46,127.64
  Top 0.508: IC4.14 79.38,125.73 | 79.38,125.73 79.38,126.36 R2.2 | 79.38,125.73 77.95,124.3 | 77.95,124.3 75.56,121.92 D30.C | v79.38,107 IC3.14 | v78.11,116.84 78.11,124.14 77.95,124.3 | C14.1 135.25,83.5 IC1.8 135.57,84.14 132.72,87 127.95,87 127,87.95 v120.02,87.95 | v120.02,110.81 121.92,110.81 R50.1 | v108.27,119.06 104.14,119.06 103.19,118.11 D24.C 102.87,118.11 100.97,116.2 100.65,115.89 v93.98,115.89 | D28.C 104.46,97.79 105.41,96.84 v107.63,96.84 | D26.C 104.46,107.95 105.41,108.9 v107.95,108.9 | v104.46,127.64 103.19,128.91 D22.C | v21.27,15.88 21.27,9.53 D91.A | 96.52,10.79 C36.1 | C11.1 93.34,10.79 | 95.89,74.93 93.34,74.93 92.23,76.04 | 95.89,74.93 NEBULA_A.18 | 92.23,76.04 90.81,77.47 NEBULA_A.9 86.36,77.47 C8.1 86.36,77.79 82.87,74.3 | IC2.14 79.38,70.8 82.87,74.3 | 135.73,25.56 135.25,25.08 IC8.8 | 135.73,25.56 C33.1 | 135.89,19.05 135.89,25.4 135.73,25.56 | 135.89,19.05 I2C.1 | 104.46,22.86 104.46,30.48 R27.2 104.14,30.48 104.14,43.5 100.97,46.67 100.97,55.56 | 100.97,55.56 96.2,55.56 95.89,55.88 U$1.1 95.89,56.2 95.89,74.93 | 100.97,55.56 102.87,55.56 C3.1 | 135.89,19.05 108.27,19.05 104.46,22.86 | 104.46,22.86 R26.2 | v92.39,89.85 92.39,76.2 92.23,76.04 | U2.6 120.81,169.39 118.11,169.39 C2.1 117.95,169.39 117,170.34 117,172.24 118.11,173.35 119.57,173.35 119.65,173.43 120.89,173.43 U2.1 | 82.87,74.3 78.74,78.42 C4.1 | C12.1 90.17,10.79 | U2.6 121.13,169.39 122.4,168.12 124.94,168.12 125.73,168.91 125.73,171.45 124.53,172.65 U2.12 | U2.6 121.84,169.45
  Top 2.54: IC22.4 101.58,10.79 96.52,10.79 93.34,10.79 90.17,10.79 77.35,10.79 73.21,6.66 66.16,6.66 62.02,10.79 C28.+
  Bottom 0.508: 79.38,112.39 79.38,115.57 79.22,115.73 | 79.38,112.39 v79.38,107 | v78.11,116.84 79.22,115.73 | 116.36,110.97 v108.27,119.06 108.27,125.09 105.73,127.64 v104.46,127.64 | 116.36,110.97 116.52,110.81 v120.02,110.81 v120.02,87.95 | v107.63,96.84 107.63,102.23 111.12,105.73 | 116.36,110.97 111.12,105.73 | 111.12,105.73 v107.95,108.9 | v93.98,115.89 79.38,115.89 79.22,115.73 | v21.27,15.88 49.53,15.88 51.44,13.97 C28.+ | 79.38,112.39 77.79,112.39 77.15,111.76 77.15,105.09 v92.39,89.85
  Bottom 1.27: U$1.1 91.45,55.89 89.53,53.98 89.53,13.34 87,10.79 76.36,10.79 72.69,7.12 66.68,7.12 63.01,10.79 C28.+
+5V  (via drill 0.35, 0.65)
  Top 0.508: 41.91,104.14 K6.+ 43.81,109.22 47.31,109.22 57.78,119.7 57.78,121.6 57.47,121.92 54.93,121.92 | 41.91,104.14 K5.+ 42.55,101.6 45.09,99.06 51.12,99.06 55.56,94.61 58.42,94.61 D13.C 58.42,94.3 58.74,93.98 61.59,93.98 D18.A | 41.91,104.14 42.03,104.02 D12.C 58.42,103.82 58.74,103.5 61.59,103.5 D19.A | 54.93,121.92 54.93,123.83 R3.2 | 54.93,121.92 54.93,120.65 R4.2 | C32.1 137.16,96.2 135.57,96.2 133.67,94.3 132.72,94.3 LED_ARRAY.1 | v21.27,8.26 21.27,6.99 D92.A | 106.68,4.45 C35.1 | 109.22,4.45 C6.1 | 113.35,11.75 112.39,12.7
  Top 0.813: v117.47,15.88 113.35,11.75
  Top 1.905: C89.+ 43.18,10.79 46.99,14.61 61.65,14.61 66.55,19.51 73.45,19.51 78.36,14.61 110.49,14.61 112.39,12.7 112.39,5.71 111.12,4.45 109.22,4.45 106.68,4.45 103.92,4.45 IC22.3
  Bottom 0.508: LED_ARRAY.1 132.72,93.98 136.53,90.17 136.84,90.17 137.48,89.53 137.48,64.77 132.72,60.01 5V_CTRL_LAZERS.8 | 21.27,13.34 v21.27,8.26 | 120.65,55.56 U$1.30 | K5.+ 41.91,88.27 51.44,78.74 51.44,64.14 31.75,64.14 10.79,43.18 10.79,42.52
  Bottom 0.813: 120.65,55.56 117.47,52.39 v117.47,15.88
  Bottom 1.27: 5V_CTRL_LAZERS.8 132.7,59.69 131.44,59.69 129.54,57.78 129.54,55.88 | 129.54,55.88 129.54,55.24 | 129.54,55.24 129.54,52.07 | 129.54,52.07 129.54,48.26 130.18,47.62 132.63,47.62 5V_CTRL_LAZERS.2 | 5V_CTRL_LAZERS.4 129.91,51.7 129.54,52.07 | 5V_CTRL_LAZERS.6 130,55.7 129.54,55.24 | U$1.30 129.53,55.89 129.54,55.88
  Bottom 2.54: C89.+ 36.83,11.43 34.92,13.34 21.27,13.34 4.83,13.34 2.29,15.88 2.29,41.27 3.54,42.52 POWER_IN.2 10.79,42.52 12.09,42.52 15.27,39.34 NID35-5.VOUT1 NID35-5.VOUT2 NID35-5.VOUT3 NID35-5.VOUT4
+5V/2
  Top 2.54: K3.NO 25.4,80.65 33.73,72.31 43.24,72.31 45.09,70.47 45.09,47.62 46.95,45.76 SKA15B-05.+VOUT
+12V  (via drill 0.35)
  Top 0.508: D16.A 61.59,73.66 58.74,73.66 58.42,73.98 D15.C
  Top 1.27: D93.A 21.27,4.45 22.86,6.03 22.86,20.94 NID35-12.VOUT4 NID35-12.VOUT3 NID35-12.VOUT2 NID35-12.VOUT1 13.98,22.26 13.96,22.24 12.7,23.5 12.7,50.8 10.79,52.7 10.77,52.68 POWER_IN.4 | ULN1.10 117.79,71.12 v118.11,70.8 | K3.1 38.73,85.72 38.73,75.56 43.18,75.56 44.45,74.3 58.42,74.3 D15.C
  Bottom 1.27: K1.2 39.37,146.69 37.47,144.78 37.47,118.11 | 33.02,95.25 37.47,99.69 37.47,118.11 | 33.02,95.25 26.67,88.9 3.81,88.9 1.91,87 1.91,58.37 POWER_IN.4 | 37.47,118.11 K2.2 105.09,118.11 | 105.09,118.11 v105.09,115.57 v105.09,105.09 v105.09,95.57 114.3,86.36 114.3,77.47 118.11,73.66 v118.11,70.8 | 105.09,118.11 v105.09,126.36 | K3.1 33.02,95.25
+24V  (via drill 0.65)
  Top 0.305: C25.1 132.4,148.91 131.13,150.18 EPP-120S-24.OUT+ | 58.42,84.14 D14.C | 58.9,83.66 61.59,83.66 D17.A 61.59,83.82 58.42,83.82
  Top 1.27: D14.C 58.42,83.82 v58.42,81.28
  Top 2.54: SKA15B-05.+VIN 29.21,53.34 20.32,53.34 15.24,58.42 5.08,58.42 2.29,61.21 2.29,83.82 4.8,86.34 FIRE_OUT.3
  Bottom 0.305: NID35-5.VIN1 54.07,35.08 54.61,35.08 55.88,34.29 NID35-5.VIN2 55.91,34.38 55.97,34.45 54.61,34.45 | NID35-12.VIN1 53.5,22.38 54.61,22.91 | NID35-12.VIN2 55.93,21.16 54.61,21.64
  Bottom 1.27: v58.42,81.28 58.42,61.34
  Bottom 2.54: X1.2 12.68,26.01 15.24,28.57 54.61,28.57
  Bottom 3.81: EPP-120S-24.OUT+ 122.68,150.21 122.68,68.07 115.95,61.34 58.42,61.34 54.61,61.34 | 54.61,61.34 45.48,61.34 37.54,53.4 SKA15B-05.+VIN | 54.61,21.64 54.61,22.91 54.61,28.57 54.61,34.45 | 54.61,35.08 54.61,61.34
A0  (via drill 0.35)
  Top 0.305: 63.5,122.87 60.96,122.87 | NEBULA_A.21 98.42,78.74 v97.16,80.01 | v69.22,111.12 60.01,120.33 60.01,121.92 60.96,122.87 | 60.96,122.87 C7.1 | 73.03,26.04 D1.A 73.66,26.04 73.66,27.3 74.3,27.94 74.3,61.59 71.12,64.77 v71.12,67.31 | 63.5,122.87 63.5,129.22 64.77,130.49 64.77,142.88 | 64.77,143.19 64.77,142.88 | 63.5,122.87 R8.1 | 64.77,142.88 U1.3
  SIGNAL3 0.305: v71.12,67.31 71.12,72.39 78.74,80.01 v97.16,80.01
  Bottom 0.305: v97.16,80.01 74.3,102.87 74.3,106.05 v69.22,111.12
A1
  Top 0.305: NEBULA_A.22 104.14,80.01 105.41,81.28 ULN1.1
A2  (via drill 0.35)
  Top 0.305: v100.97,81.28 NEBULA_A.23 | v103.19,79.06 104.46,79.06 105.41,80.01 ULN1.2
  Bottom 0.305: v103.19,79.06 v100.97,81.28
A3
  Top 0.305: NEBULA_A.24 107,82.55 107.95,81.6 107.95,79.69 107,78.74 ULN1.3
A4
  Top 0.305: NEBULA_A.25 106.68,83.82 113.67,76.83 113.67,68.9 129.54,53.02 129.54,34.92 132.72,31.75 IC8.3
A5  (via drill 0.35)
  Top 0.305: NEBULA_A.26 114.3,85.09 117.79,81.6 v117.79,75.88 | v131.44,43.81 131.44,34.29 133.99,31.75 IC8.2
  SIGNAL3 0.305: v117.79,75.88 131.44,62.23 v131.44,43.81
A6  (via drill 0.35)
  Top 0.305: v117.47,86.36 NEBULA_A.27 | v117.47,92.39 119.06,92.39 120.02,93.34 129.54,93.34 132.72,90.17 IC1.3
  Bottom 0.305: v117.47,92.39 v117.47,86.36
A7  (via drill 0.35)
  Top 0.305: v111.12,87.63 NEBULA_A.28 | v133.03,91.12 133.99,90.17 IC1.2
  SIGNAL3 0.305: v111.12,87.63 114.94,87.63 118.43,91.12 v133.03,91.12
BOOMER_BLOWER  (via drill 0.35)
  Top 0.305: R38.1 109.22,90.17 111.44,90.17 112.39,91.12 C22.1 112.39,91.44 119.06,91.44 120.02,92.39 v125.41,92.39 | STAR_INPUT.2 132.72,67.63 132.08,67.63 127.32,72.39 D10.2 125.73,72.39 125.41,72.71 v125.41,74.93
  Bottom 0.305: v125.41,74.93 v125.41,92.39
BOOMER_FUEL  (via drill 0.35)
  Top 0.305: 111.44,100.33 109.22,100.33 R31.1 | 111.44,100.33 112.39,101.28 C20.1 | STAR_INPUT.3 132.72,69.53 132.08,69.53 126.05,75.56 126.05,76.83 D5.2 125.73,76.83 124.14,78.42 124.14,81.6 122.24,83.5 v119.06,83.5 | v111.44,100.01 111.44,100.33
  Bottom 0.305: v111.44,100.01 111.44,91.12 v119.06,83.5
BOOMER_IGNITER  (via drill 0.35)
  Top 0.305: 112.39,111.44 111.44,110.49 109.22,110.49 R22.1 | 126.36,79.38 130.18,75.56 130.18,73.34 132.08,71.44 132.72,71.44 STAR_INPUT.4 | 126.36,79.38 126.05,79.69 126.05,81.28 D11.2 | 112.39,111.44 116.2,111.44 v125.41,102.23 | 126.36,79.38 v126.36,83.82 | 112.39,111.44 C18.1
  Bottom 0.305: v125.41,102.23 125.41,93.66 126.36,92.71 v126.36,83.82
EN_STATUS  (via drill 0.35)
  Top 0.305: v84.77,114.94 85.72,115.89 IC4.6 | v69.69,83.82 69.69,50.8 54.77,35.88 54.77,33.5 23.18,1.91 D94.A
  SIGNAL3 0.305: v84.77,114.94 78.42,108.58 78.42,99.06 69.69,90.33 v69.69,83.82
EXP_ULN0  (via drill 0.35)
  Top 0.305: 71.44,28.57 D2.C 71.75,28.57 71.75,62.87 v70.48,64.14 | ULN1.18 114.94,81.28 v112.08,84.14
  SIGNAL3 0.305: v112.08,84.14 89.85,106.36 89.85,116.52 89.53,116.84 89.53,120.33 82.55,127.64 | v61.59,149.54 82.55,127.64 | v70.48,64.14 70.48,66.67 67.31,69.85 67.31,112.39 82.55,127.64
  Bottom 0.305: v61.59,149.54 60.64,148.59 46.99,148.59 40.64,154.94 K1.1
EXP_ULN1  (via drill 0.35)
  Top 0.305: v113.03,80.01 ULN1.17 | K2.1 v52.39,116.52 | v73.03,64.14 74.93,62.23 74.93,26.04 73.66,24.77 73.03,24.77 71.75,23.5 D3.C
  Bottom 0.305: v113.03,80.01 104.78,80.01 96.84,87.95 93.03,87.95 74.93,106.05 74.93,106.68 65.41,116.2 65.09,116.52 | v52.39,116.52 65.09,116.52 | v73.03,64.14 73.03,72.39 59.69,85.72 59.69,116.84 64.77,116.84 65.09,116.52
EXP_ULN2
  Top 0.305: ULN1.16 115.25,78.74 114.3,77.79 114.3,70.8 127.32,57.78 132.72,57.78 5V_CTRL_LAZERS.7
EXP_ULN5  (via drill 0.35)
  Top 0.305: ULN1.13 122.87,74.93 124.14,73.66 124.14,71.44 133.35,62.23 134.94,62.23 v135.89,61.28
  Bottom 0.305: v135.89,61.28 135.89,56.52 133.35,53.98 132.72,53.98 5V_CTRL_LAZERS.5
EXP_ULN6  (via drill 0.35)
  Top 0.305: ULN1.12 117.47,73.66 118.11,74.3 122.56,74.3 123.51,73.34 123.51,71.12 133.03,61.59 134.3,61.59 135.57,60.33 v135.57,54.93
  Bottom 0.305: v135.57,54.93 135.57,52.07 133.35,49.85 132.72,49.85 5V_CTRL_LAZERS.3
EXP_ULN7
  Top 0.305: ULN1.11 118.43,72.39 129.86,60.96 133.99,60.96 134.62,60.33 134.62,47.31 132.72,45.4 5V_CTRL_LAZERS.1
GND  (via drill 0.35, 1.27)
  Top 0.305: U3.2 80.64,79.38 | C4.2 79.8,80.22 80.64,79.38 | U3.4 84.32,78.88 84.45,78.74 84.45,78.11 81.28,78.11 80.64,78.74 80.64,79.38 | U4.3 102.25,121.3 102.23,121.28 | U7.3 102.25,111.3 102.08,111.13 102.08,110.48 102.23,110.33 102.23,109.86 | U6.3 102.25,90.19 102.23,90.17 | U5.3 103.82,101.92 105.73,100.01 106.68,100.01
  Top 0.508: 72.81,113.03 R6.1 | C7.2 60.96,121.28 v62.23,121.28 63.5,121.28 R8.2 63.5,120.97 66.04,120.97 | 66.04,120.97 70.8,120.97 72.39,119.38 D31.A 72.39,115.89 71.75,115.25 71.75,113.98 72.71,113.03 R6.1 | 66.04,120.97 R7.2 | 75.56,112.71 73.03,112.71 | 73.03,112.71 73.03,109.86 Q1.3 | 73.03,112.71 R6.1 | 75.56,112.71 75.56,110.49 | 75.56,110.49 75.56,104.14 73.34,101.92 73.34,100.33 Q2.3 | 75.56,112.71 C16.2 | 94.61,111.12 94.61,109.86 102.23,109.86 103.19,109.86 103.5,110.17 106.68,110.17 C19.2 | 94.61,111.12 94.61,112.71 95.57,113.67 95.89,113.67 D7.C | 87,117.16 IC4.7 87,113.03 | R23.1 109.22,114.3 112.39,114.3 C18.2 112.39,114.62 112.71,114.94 112.71,118.11 | 94.61,121.28 94.61,117.79 89.85,113.03 87.95,113.03 | 94.61,121.28 94.61,123.51 95.57,124.46 95.89,124.46 D6.C | 87.95,113.03 87,113.03 | 87,113.03 83.19,113.03 C17.2 83.19,112.71 80.96,110.49 75.56,110.49 | 94.61,121.28 102.23,121.28 106.68,121.28 C15.2 106.68,120.97 107.63,120.02 109.54,120.02 111.44,118.11 112.71,118.11 | 112.71,118.11 D25.A | 94.61,111.12 89.85,111.12 87.95,113.03 | Q4.3 73.03,80.01 v73.03,81.28 73.03,82.55 71.12,84.45 71.12,87.95 73.03,89.85 Q3.3 73.34,90.17 | 94.77,91.28 95.89,90.17 102.23,90.17 106.68,90.17 C23.2 | 94.77,91.28 94.61,91.44 94.61,92.39 95.57,93.34 95.89,93.34 D9.C | D8.C 95.89,103.5 95.57,103.5 94.61,102.55 94.61,97.47 91.28,94.14 89.69,95.73 | 89.69,95.73 87,98.42 IC3.7 | 94.77,91.28 94.3,90.81 89.85,90.81 89.69,90.96 | 89.69,90.96 89.53,91.12 89.53,95.57 89.69,95.73 | 89.69,90.96 88.9,90.17 v76.2,90.17 76.83,89.06 76.83,82.23 78.74,80.33 C4.2 | 112.39,104.14 v110.81,104.14 109.54,104.14
  Top 0.508: 109.54,104.14 109.22,104.14 R32.1 109.54,104.14 | 109.54,104.14 113.35,107.95 D27.A | 121.6,97.79 121.6,100.33 D4.1 | 121.6,97.79 121.6,95.89 D21.1 | R39.1 109.22,93.98 112.39,93.98 C22.2 112.39,97.79 D29.A | C21.2 106.68,100.01 107.31,100.01 108.58,98.74 111.76,98.74 112.71,97.79 D29.A | D29.A 118.75,97.79 | 118.75,97.79 121.6,97.79 | 118.75,97.79 112.39,104.14 | 112.39,104.14 C20.2 | C6.2 106.68,8.57 C35.2 106.68,8.26 102.87,8.26 99.38,4.76 IC22.1 99.06,4.76 98.42,4.76 96.52,6.67 | 96.52,6.67 v95.25,6.67 93.66,6.67 93.34,6.35 | 93.34,6.35 90.17,6.35 C12.2 | 93.34,6.35 C11.2 | 96.52,6.67 C36.2 | NEBULA_A.10 v88.27,76.2 87.63,76.2 | 87.63,76.2 86.36,76.2 C8.2 | IC2.7 87,66.36 87.95,67.31 87.95,70.17 87.63,70.48 87.63,76.2 | 121.6,79.69 121.6,81.28 D11.1 | 121.6,79.69 121.6,76.83 D5.1 | D139.1 120.02,85.72 119.22,84.93 | 119.22,84.93 v119.06,84.77 118.11,83.82 118.11,83.19 121.6,79.69 | D20.1 120.97,90.17 119.06,88.27 119.06,85.09 119.22,84.93 | C1.2 127,20.32 131.44,24.77 IC8.5 131.44,26.67 133.03,28.26 136.84,28.26 137.16,28.57 C33.2 137.16,31.43 133.35,35.24 132.72,35.24 DMX_OUT.1 | R14.1 109.22,125.09 112.39,125.09 C13.2 | D23.A 112.71,128.91 112.71,125.73 112.39,125.41 C13.2 | 15.56,4.45 15.56,1.91 R139.2 | 15.56,9.53 15.56,6.99 | 15.56,6.99 15.56,4.45 | 15.56,4.45 R132.2 | 15.56,6.99 R131.2 | 99.38,72.39 99.38,71.12 NEBULA_A.15 99.06,71.12 v99.06,69.85 | 99.38,72.39 99.38,73.66 NEBULA_A.17 | 99.38,72.39 NEBULA_A.16 | v102.87,52.39 C3.2 | C32.2 137.16,98.11 135.57,98.11 133.67,100.01 132.72,100.01 LED_ARRAY.4 | C25.2 132.72,147 131.13,145.41 EPP-120S-24.OUT- | v135.57,87.31 C14.2 | v106.36,69.85 106.36,71.12 ULN1.9
  Top 0.508: v131.44,85.09 IC1.5 | v119.7,72.39 D10.1 | 15.56,9.53 15.56,12.7 7.62,20.64 X1.1 | 15.56,9.53 R130.2 | OVERRIDE_EN2.3 114.62,125.41 112.71,125.41 C13.2 | v119.54,170.97 120.81,170.97 U2.4 120.97,170.81 120.97,170.34 U2.5 | v119.54,170.97 118.11,170.97 C2.2 | U2.2 120.83,172.65 120.81,172.64 119.93,172.64 119.38,172.09 119.38,171.13 v119.54,170.97
  Top 2.54: v76.2,90.17 73.34,90.17 | JP1.1 JP1.2 JP1.4 JP1.3 6.99,66.04
  pour $GND (no thermals): 65.41,188.59 140.34,188.59 140.34,-0.64 -0.64,-0.64 -0.64,67.31 14.61,67.31 50.16,67.31 50.16,128.27 65.41,128.27
GND3
  Bottom 2.54: FIRE_OUT.2 10.5,81.26 13.02,78.74 13.02,68.58 15.6,66 SKA15B-05.-VOUT
LOCAL_EN  (via drill 0.35)
  Top 0.305: R37.1 84.45,109.54 80.64,109.54 R44.1 80.64,109.22 80.33,109.22 78.42,107.31 78.42,93.66 | v108.9,35.56 112.71,31.75 124.78,31.75 125.73,30.8 125.73,30.48 R49.1 | v97.16,38.42 97.16,43.5 96.2,44.45 95.25,44.45 70.8,68.9 70.8,83.82 70.17,84.45 70.17,89.85 70.8,90.49 | 70.8,90.49 73.98,93.66 78.42,93.66 | 80.64,93.66 78.42,93.66 | 80.64,93.66 84.45,93.66 R30.1 | 80.64,93.66 R21.1 | v83.19,119.38 IC4.4 | v71.12,119.38 71.12,115.57 70.8,115.25 70.8,90.49
  Bottom 0.305: v108.9,35.56 100.01,35.56 v97.16,38.42 | v71.12,119.38 v83.19,119.38
N$1
  Top 0.305: C1.1 120.65,20.32 U$1.16
N$2  (via drill 0.35)
  Top 0.305: v69.85,138.11 79.38,128.59 R2.1 | v67.94,148.27 64.77,148.27 61.91,145.41 U1.4
  Bottom 0.305: v69.85,138.11 69.85,146.37 v67.94,148.27
N$3  (via drill 0.35)
  Top 0.305: 56.83,120.65 R4.1 56.52,120.65 56.52,120.02 v55.88,119.38 | v73.03,54.61 73.03,28.57 D2.A
  SIGNAL3 0.305: v73.03,54.61 55.88,71.75 v55.88,119.38
N$4  (via drill 0.35)
  Top 0.305: 73.03,23.5 D3.A 73.66,23.5 76.2,26.04 76.2,62.23 v74.3,64.14 | 56.83,123.83 R3.1 57.15,123.83 59.05,121.92 59.05,120.02 64.77,114.3 v64.77,110.49
  Bottom 0.305: v74.3,64.14 74.3,72.39 64.77,81.92 v64.77,110.49
N$5  (via drill 0.35)
  Top 0.305: DMX_OUT.2 133.03,37.78 137.16,37.78 R5.2 | v133.99,26.67 IC8.7
  Bottom 0.305: v133.99,26.67 133.99,36.2 DMX_OUT.2
N$6  (via drill 0.35)
  Top 0.305: R5.1 137.16,39.69 132.72,39.69 DMX_OUT.3 | v132.72,26.67 IC8.6
  Bottom 0.305: v132.72,26.67 132.72,33.34 131.44,34.61 131.44,38.1 132.72,39.37 DMX_OUT.3
N$7
  Top 1.27: FOG_IN.3 6.98,147.32 19.68,147.32 30.48,158.12 30.48,166.37 31.27,167.16 R13.1
N$8
  Top 1.27: R13.2 R12.1
N$9
  Top 1.27: R12.2 R11.1
N$10
  Top 1.27: R11.2 R10.1
N$11
  Top 1.27: R10.2 52.22,167 53.98,167 54.61,166.37 54.61,146.69 53.34,145.41 U1.1
N$12  (via drill 0.35)
  Top 0.305: 71.44,26.04 D1.C 71.12,26.04 71.12,27.3 70.48,27.94 v70.48,58.42 | 66.04,122.87 R7.1 66.04,123.19 v64.77,121.92
  SIGNAL3 0.305: v70.48,58.42 70.48,62.87 66.04,67.31 66.04,120.65 v64.77,121.92
N$13
  Bottom 3.81: FOG_IN.2 15.26,142.22 K2.NO
N$14
  Bottom 3.81: FOG_IN.4 18.44,152.38 K1.C
N$15
  Top 1.27: K2.C 32.38,118.75 32.38,130.81 44.45,142.88 U1.2
  Bottom 3.81: FOG_IN.1 27.94,116.16 K2.C
N$16  (via drill 0.35)
  Top 0.305: U4.4 101.54,124.7 100.58,124.7 100.51,124.78 98.42,124.78 R16.2 98.42,125.73 95.25,125.73 93.34,123.83 93.34,119.38 v88.27,114.3 | IC3.1 79.38,101.6 v80.64,102.87
  $GND 0.305: v80.64,102.87 80.64,106.68 v88.27,114.3
N$17
  Top 0.305: 109.22,128.91 R14.2 109.22,126.36 108.9,126.36 107.95,125.41 107.95,122.87 | 109.22,128.91 D22.A | 109.22,128.91 D23.C | 107.95,122.87 109.22,122.87 R9.2 | 107.95,122.87 106.68,122.87 | 106.68,122.87 C15.1 | U4.2 101.64,123.55 101.64,123.98 101.88,124.22 105.34,124.22 106.68,122.87
N$18
  Top 0.305: D6.A 95.89,122.87 98.42,122.87 R16.1
N$21
  Top 0.305: IC4.2 R20.1
N$22
  Top 0.305: 83.19,114.62 81.92,113.35 | 81.92,113.35 81.6,113.03 80.64,113.03 R20.2 | 81.92,113.35 IC4.3 | 83.19,114.62 84.45,115.89 IC4.5 84.45,118.43 88.58,122.56 88.58,124.14 94.3,129.86 113.67,129.86 128.59,114.94 128.59,110.49 | 83.19,114.62 C17.1 | 128.59,110.49 127,110.49 OVERRIDE_EN2.2 | 128.59,110.49 OVERRIDE_EN.2
N$23
  Top 0.305: 75.56,114.62 73.03,114.62 R6.2 | 75.56,114.62 77.15,114.62 | 77.15,114.62 78.11,114.62 R19.2 | 75.56,114.62 D30.A 75.56,118.43 72.39,121.6 D31.C | 75.56,114.62 C16.1 | 77.15,114.62 79.38,116.84 IC4.1
N$24
  Top 0.305: IC3.2 R21.2
N$25  (via drill 0.35)
  Top 0.305: D29.C D28.A 106.36,97.79 v103.82,100.33 | 107.95,112.08 109.22,112.08 R22.2 | 107.95,112.08 106.68,112.08 | 107.95,112.08 107.95,114.62 108.9,115.57 109.22,115.57 R23.2 | 106.68,112.08 104.14,112.08 103.03,110.97 | 106.68,112.08 C19.1 | 103.03,110.97 v102.87,110.81 | U7.2 101.64,112.12 101.64,112.55 101.88,112.79 102.62,112.79 102.86,112.55 102.86,111.14 103.03,110.97
  Bottom 0.305: v103.82,100.33 103.82,109.86 v102.87,110.81
N$26  (via drill 0.35)
  Top 0.305: U7.4 101.54,113.27 100.58,113.27 99.97,113.88 R25.2 98.42,114.3 v97.16,113.03 | IC3.4 83.19,99.69 86.36,102.87 v87,102.87
  Bottom 0.305: v97.16,113.03 v87,102.87
N$27
  Top 0.305: D7.A 95.89,112.08 98.42,112.08 R25.1
N$30
  Top 0.305: IC3.5 R30.2
N$31  (via drill 0.35)
  Top 0.305: D25.C 107.63,118.11 | 107.63,118.11 D24.A | 107.95,101.92 109.22,101.92 R31.2 | 107.95,101.92 106.68,101.92 | 107.95,101.92 107.95,104.46 108.9,105.41 109.22,105.41 R32.2 109.22,105.73 v107.95,107 | 106.68,101.92 C21.1 | v107.63,117.16 107.63,118.11 | U5.2 101.64,101.96 101.64,102.39 102.12,102.87 105.73,102.87 106.68,101.92
  Bottom 0.305: v107.63,117.16 107.63,110.49 107,109.86 107,107.95 v107.95,107
N$32
  Top 0.305: U5.4 101.54,103.11 100.58,103.11 99.97,103.72 R34.2 98.42,106.05 86.36,106.05 85.72,105.41 IC3.9
N$33
  Top 0.305: D8.A 95.89,101.92 98.42,101.92 R34.1
N$36
  Top 0.305: IC3.10 R37.2
N$37
  Top 0.305: D26.A D27.C 111.44,107.95 112.39,108.9 115.89,108.9 123.51,101.28 123.51,94.93 122.56,93.98 114.62,93.98 113.35,92.71 107.95,92.71 | 107.95,91.76 109.22,91.76 R38.2 | 107.95,91.76 106.68,91.76 | 107.95,91.76 107.95,92.71 | 107.95,92.71 107.95,94.3 108.9,95.25 109.22,95.25 R39.2 | 106.68,91.76 C23.1 | U6.2 101.64,92.44 101.64,92.86 102.12,93.34 105.09,93.34 106.68,91.76
N$38  (via drill 0.35)
  Top 0.305: U6.4 101.52,93.56 R41.2 98.42,93.98 v96.52,95.89 | v81.92,106.68 IC3.12
  Bottom 0.305: v81.92,106.68 92.71,95.89 v96.52,95.89
N$39
  Top 0.305: D9.A 95.89,91.76 98.42,91.76 R41.1
N$42
  Top 0.305: IC3.13 R44.2
N$43  (via drill 0.35)
  Top 0.305: v113.67,55.56 113.67,45.72 120.02,39.37 124.78,39.37 125.73,38.42 125.73,38.1 R45.1 | v82.55,96.84 81.92,97.47 IC3.3
  SIGNAL3 0.305: v113.67,55.56 113.67,65.72 v82.55,96.84
N$44  (via drill 0.35)
  Top 0.305: v105.09,69.53 105.09,51.75 120.02,36.83 126.36,36.83 127,37.47 127,38.73 126.05,39.69 126.05,40.64 R46.1 | v83.5,91.12 85.72,93.34 IC3.6
  Bottom 0.305: v83.5,91.12 v105.09,69.53
N$45  (via drill 0.35)
  Top 0.305: v108.58,78.74 108.58,73.03 125.73,55.88 125.73,43.18 R47.1 | v88.58,102.87 87,104.46 IC3.8
  SIGNAL3 0.305: v108.58,78.74 99.06,88.27 98.74,88.27 88.58,98.42 v88.58,102.87
N$46  (via drill 0.35)
  Top 0.305: v125.73,34.29 125.73,33.02 R48.1 | v84.14,102.55 83.19,103.5 IC3.11
  SIGNAL3 0.305: v125.73,34.29 125.73,60.33 84.14,101.92 v84.14,102.55
N$47
  Top 0.508: K5.- 50.16,101.6 53.34,98.42 55.03,98.42 R61.2 58.33,98.64 D13.A 65.6,98.55 Q2.4
N$48
  Top 2.54: K6.O2 23.47,106.66 FIRE_OUT.7
N$49
  Top 0.508: K6.- 45.3,108.17 R60.2 58.33,108.17 D12.A 65.6,108.07 Q1.4
N$50
  Top 2.54: K5.O2 16.51,101.6 11.41,96.5 FIRE_OUT.5
N$51
  Top 0.305: 55.24,91.44 R62.2
  Top 1.27: D14.A 58.42,91.44
  Top 2.54: FIRE_OUT.4 7.62,91.44 13.97,91.44 19.68,97.16 46.35,97.16 52.07,91.44 55.24,91.44 58.42,91.44 62.55,91.44 Q3.4
N$52
  Top 0.305: R15.2 55.24,78.22 55.24,78.11
  Top 0.508: 58.33,78.32 D15.A | D15.A 65.6,78.22 Q4.4 | K3.2 41.4,78.22 55.24,78.22 D15.A
N$53
  Top 2.54: K3.C 25.42,76.18 FIRE_OUT.1
N$54
  Top 0.508: D16.C 60.15,76.62 R15.1
N$55
  Top 0.508: R62.1 60.15,86.78 D17.C
N$56
  Top 0.508: R61.1 60.15,96.94 D18.C
N$57
  Top 0.508: R60.1 60.15,106.47 D19.C
N$58
  Top 0.305: R50.2 121.92,108.9 126.05,108.9 OVERRIDE_EN2.1 132.72,108.58 OVERRIDE_EN.1
N$60
  Top 0.305: IC2.3 81.92,63.82 75.25,70.48 75.25,83.19 73.34,85.09 Q3.1
N$108  (via drill 0.35)
  Top 0.305: R1.2 137.16,77.79 133.03,77.79 132.72,77.47 STAR_INPUT.7 | v133.99,81.6 IC1.7
  Bottom 0.305: v133.99,81.6 133.99,80.64 134.62,80.01 134.62,78.74 133.35,77.47 132.72,77.47 STAR_INPUT.7
N$109
  Top 0.305: 132.72,79.69 137.16,79.69 R1.1 | 132.72,79.69 IC1.6 | 132.72,79.69 STAR_INPUT.8
N$156
  Top 0.305: R130.1 D91.C
N$157
  Top 0.305: R131.1 D92.C
N$158
  Top 0.305: R132.1 D93.C
N$159
  Top 0.305: R139.1 D94.C
POOFER  (via drill 0.35)
  Top 0.305: 111.44,121.28 109.22,121.28 R9.1 | 111.44,121.28 112.39,122.24 C13.1 | D139.2 126.05,85.72 130.81,80.96 130.81,74.93 132.08,73.66 132.72,73.66 STAR_INPUT.5 | 111.44,121.28 119.06,113.67 119.06,109.86 v126.68,102.23
  Bottom 0.305: v126.68,102.23 126.68,94.3 135.89,85.09 135.89,76.2 133.35,73.66 132.72,73.66 STAR_INPUT.5
STAR_ENABLE  (via drill 0.35)
  Top 0.305: v78.11,111.44 R19.1 | v109.22,88.58 117.16,88.58 120.33,91.76 124.14,91.76 125.73,90.17 | 125.73,90.17 v127.64,92.08 | 125.73,90.17 D20.2
  Bottom 0.305: v78.11,111.44 78.11,107 96.52,88.58 v109.22,88.58 | v127.64,92.08 135.25,84.45 135.25,77.47 133.35,75.56 132.72,75.56 STAR_INPUT.6
(copper drawn outside any net)
  shapes: Bottom area x3, Top area x6

## Text on the board
tPlace: Poofer | Igniter | Fuel | Blower | + - | En / Poof / Ign / Fuel / Blow / Gnd | ISOLATED 5V | GND 5v GND 12v | 5v | Fog Power | Fog Ready | Fog Active | 12v | GND 24v | SDA SCL GND 3v3 | 5v | 3v3 | 3.3v | 3v3 / 5v / 12v / Enable
tNames: Nova: StarBase | **Warning** / High Voltage | FOG POWER | **Warning** / High Voltage | FOG / NEUTRAL / LINE / STATUS / ACTIVATE / COMMON | **Warning** / High Voltage | ACTIVATE | Poofer | POOFER | Poofer | GND | FUEL | Fuel | +5 | Fuel | Blower | Blower | IGNITER | Igniter | Igniter | GND | NOVA: STARBASE v1.3.1 / (c) Jm Casler 2023 / www.casler.org / www.oontz.com
tValues: GND / 12 TDI / 13 TCK / 14 TMS / 15 TDO